# Altium project CCD_CAM_BOARD.PrjPcb (part 3 of 4)
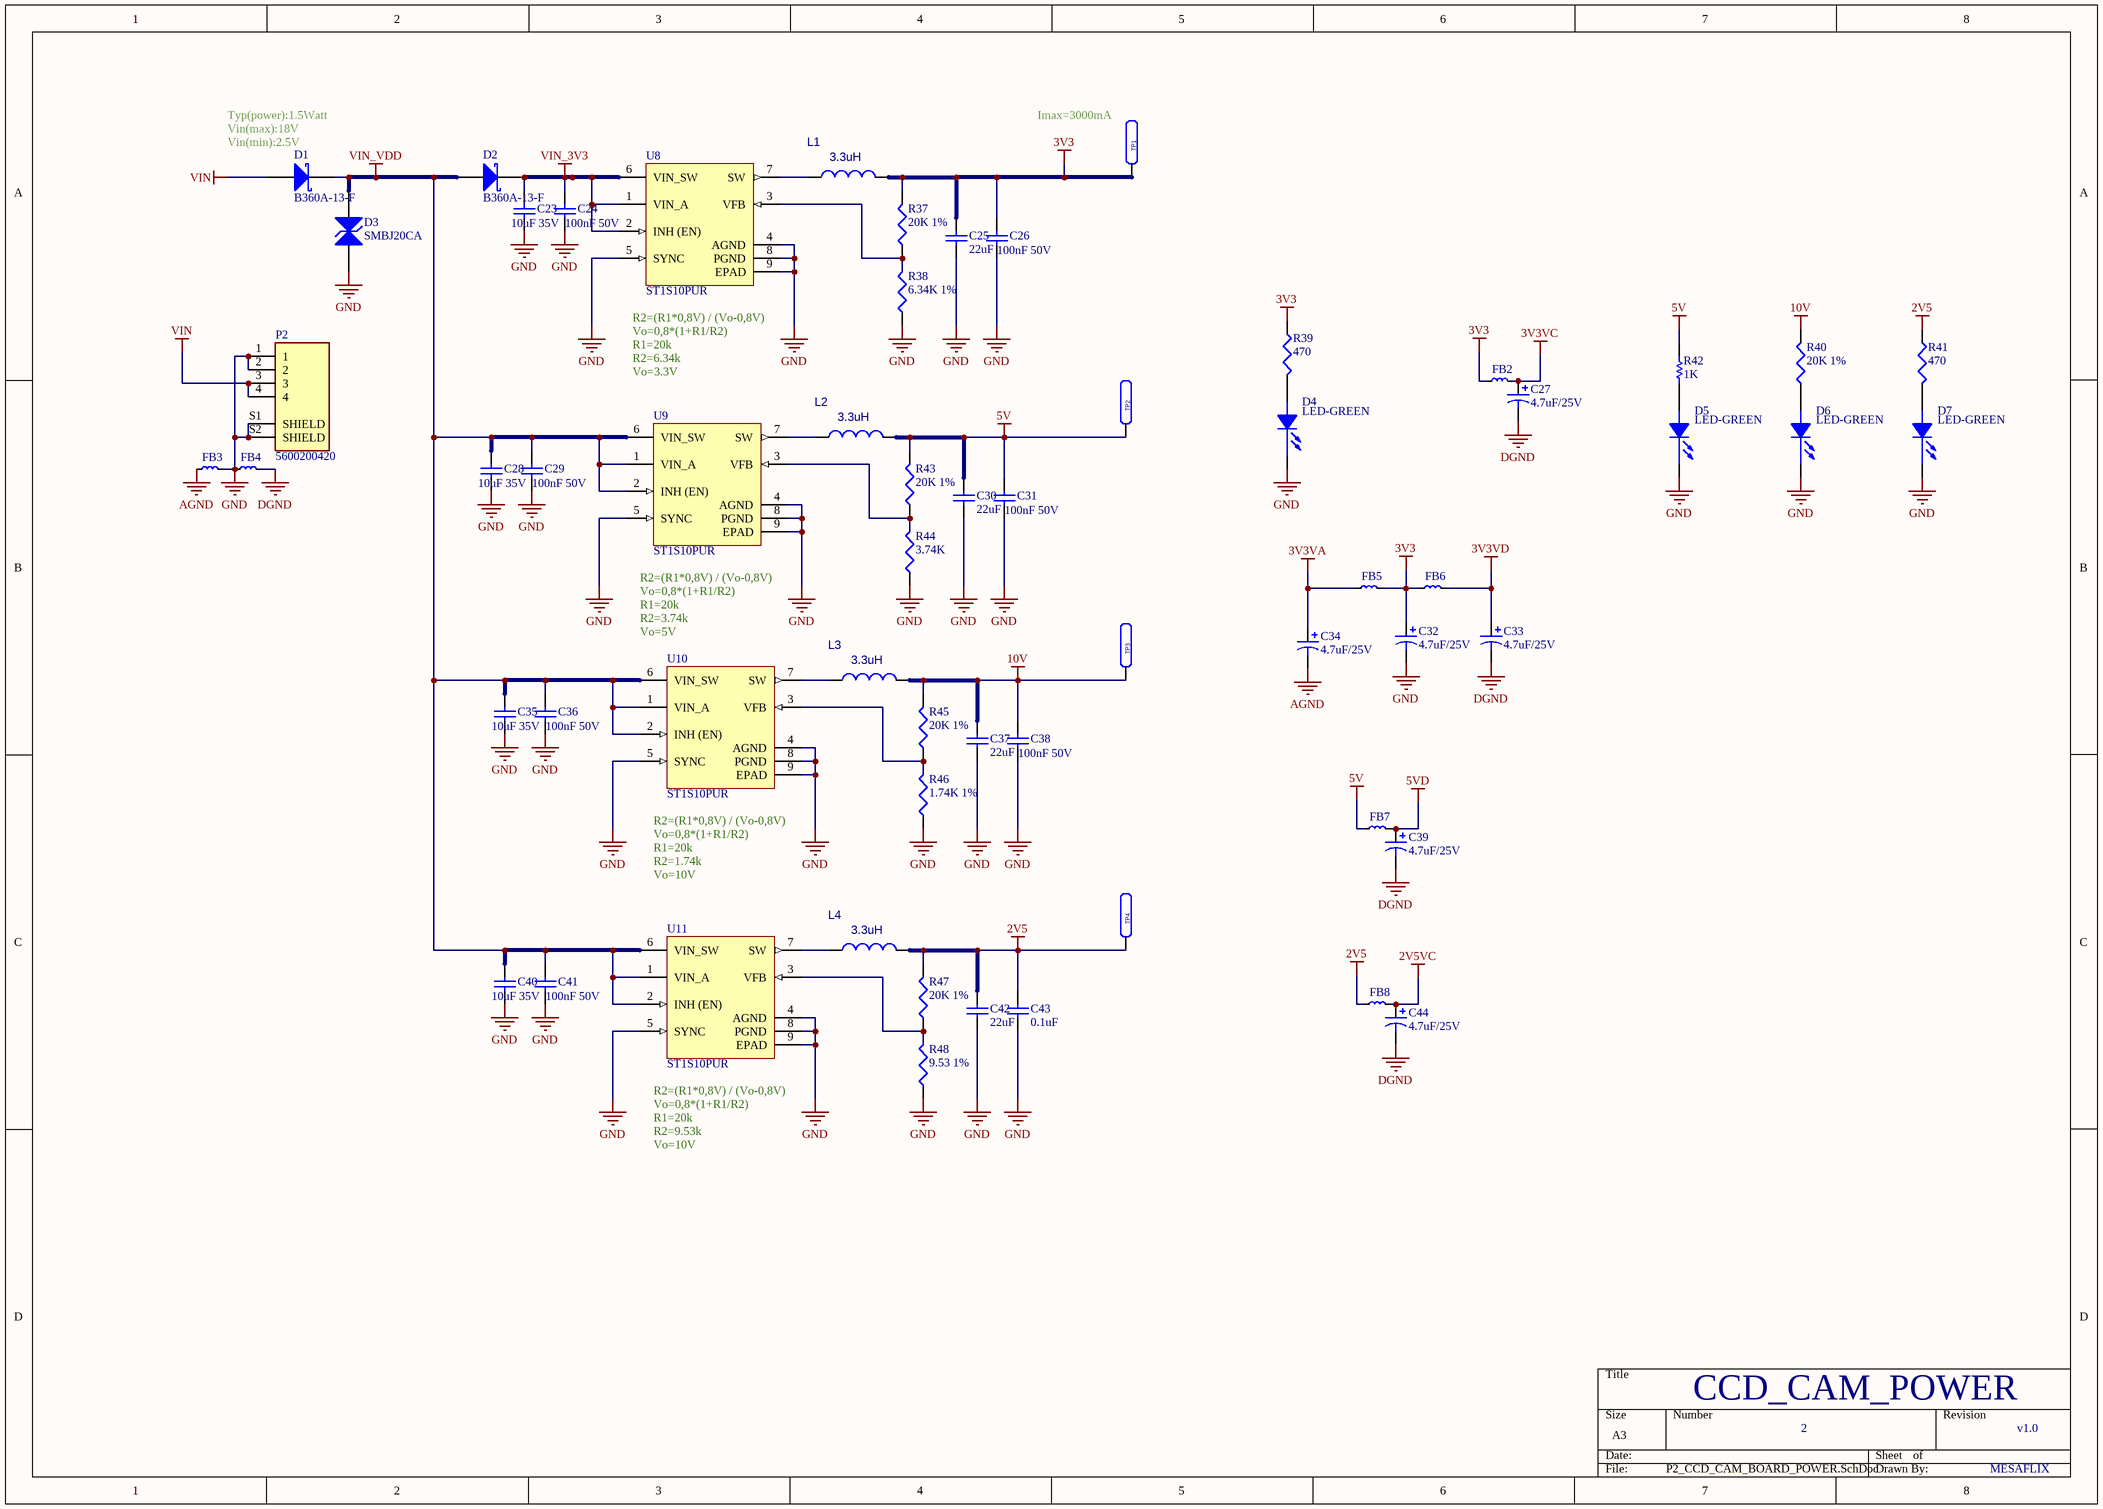
[diagram p8: P2_CCD_CAM_BOARD_POWER.SchDoc]

## Sheet P2_CCD_CAM_BOARD_POWER.SchDoc (continued)

### Library data of the parts (continued)
R46 = Res3: RES SMD 1.74K OHM 1% 1/16W 0402; MPN: RC0402FR-071K74L; ComponentLink1URL: https://datasheet.ciiva.com/11819/0900766b80c66297-11819477.pdf?src-supplier=RSComponents; ComponentLink1Description: https://datasheet.ciiva.com/11819/0900766b80c66297-11819477.pdf?src-supplier=RSComponents; ComponentLink2URL: https://datasheet.ciiva.com/12666/pyu-rc0402-51-rohs-l-6-r-12666741.pdf?src-supplier=Mouser; ComponentLink2Description: https://datasheet.ciiva.com/12666/pyu-rc0402-51-rohs-l-6-r-12666741.pdf?src-supplier=Mouser; ComponentLink3URL: https://datasheet.ciiva.com/17063/pyu-rc0402-51-rohs-l-6-r-17063193.pdf?src-supplier=Future+Electronics; ComponentLink3Description: https://datasheet.ciiva.com/17063/pyu-rc0402-51-rohs-l-6-r-17063193.pdf?src-supplier=Future+Electronics; ComponentLink4URL: https://datasheet.ciiva.com/22747/1018594-22747513.pdf?src-supplier=Element14; ComponentLink4Description: https://datasheet.ciiva.com/22747/1018594-22747513.pdf?src-supplier=Element14; ComponentLink5URL: https://datasheet.ciiva.com/7849/1018594-7849869.pdf?src-supplier=Element14; ComponentLink5Description: https://datasheet.ciiva.com/7849/1018594-7849869.pdf?src-supplier=Element14; ComponentLink6URL: https://datasheet.ciiva.com/7983/1018594-7983502.pdf?src-supplier=Element14; ComponentLink6Description: https://datasheet.ciiva.com/7983/1018594-7983502.pdf?src-supplier=Element14; ComponentLink7URL: https://datasheet.ciiva.com/7849/1018594-7849871.pdf?src-supplier=Element14; ComponentLink7Description: https://datasheet.ciiva.com/7849/1018594-7849871.pdf?src-supplier=Element14; ComponentLink8URL: https://datasheet.ciiva.com/2553/pyu-r-int-thick-7-2553200.pdf?src-supplier=Digi-Key; ComponentLink8Description: https://datasheet.ciiva.com/2553/pyu-r-int-thick-7-2553200.pdf?src-supplier=Digi-Key; ComponentLink9URL: https://datasheet.ciiva.com/7983/1018594-7983501.pdf?src-supplier=Element14; ComponentLink9Description: https://datasheet.ciiva.com/7983/1018594-7983501.pdf?src-supplier=Element14; ComponentLink10URL: https://datasheet.ciiva.com/2553/pyu-r-int-thick-7-2553201.pdf?src-supplier=Digi-Key; ComponentLink10Description: https://datasheet.ciiva.com/2553/pyu-r-int-thick-7-2553201.pdf?src-supplier=Digi-Key; ComponentLink11URL: https://datasheet.ciiva.com/2553/pyu-r-int-thick-7-2553202.pdf?src-supplier=Digi-Key; ComponentLink11Description: https://datasheet.ciiva.com/2553/pyu-r-int-thick-7-2553202.pdf?src-supplier=Digi-Key; ComponentLink12URL: https://datasheet.ciiva.com/15189/getdatasheetpartid-251817-15189388.pdf?src-supplier=Verical; ComponentLink12Description: https://datasheet.ciiva.com/15189/getdatasheetpartid-251817-15189388.pdf?src-supplier=Verical; ComponentLink13URL: https://datasheet.ciiva.com/11808/0900766b80c66297-11808454.pdf?src-supplier=RSComponents; ComponentLink13Description: https://datasheet.ciiva.com/11808/0900766b80c66297-11808454.pdf?src-supplier=RSComponents; ComponentLink14URL: https://datasheet.ciiva.com/2453/pyu-r-int-thick-7-2453494.pdf?src-supplier=Digi-Key; ComponentLink14Description: https://datasheet.ciiva.com/2453/pyu-r-int-thick-7-2453494.pdf?src-supplier=Digi-Key; ComponentLink15URL: https://datasheet.ciiva.com/2453/pyu-r-int-thick-7-2453495.pdf?src-supplier=Digi-Key; ComponentLink15Description: https://datasheet.ciiva.com/2453/pyu-r-int-thick-7-2453495.pdf?src-supplier=Digi-Key; ComponentLink16URL: https://datasheet.ciiva.com/7983/1018594-7983511.pdf?src-supplier=Element14; ComponentLink16Description: https://datasheet.ciiva.com/7983/1018594-7983511.pdf?src-supplier=Element14; ComponentLink17URL: https://datasheet.ciiva.com/12558/pyu-rc0402-51-rohs-l-6-r-8721-12558796.pdf?src-supplier=Mouser; ComponentLink17Description: https://datasheet.ciiva.com/12558/pyu-rc0402-51-rohs-l-6-r-8721-12558796.pdf?src-supplier=Mouser; ComponentLink18URL: https://datasheet.ciiva.com/2453/pyu-r-int-thick-7-2453493.pdf?src-supplier=Digi-Key; ComponentLink18Description: https://datasheet.ciiva.com/2453/pyu-r-int-thick-7-2453493.pdf?src-supplier=Digi-Key; ComponentLink19URL: https://datasheet.ciiva.com/46394/1018594-46394974.pdf?src-supplier=Element14; ComponentLink19Description: https://datasheet.ciiva.com/46394/1018594-46394974.pdf?src-supplier=Element14; ComponentLink20URL: https://datasheet.ciiva.com/15189/getdatasheetpartid-323692-15189807.pdf?src-supplier=Verical; ComponentLink20Description: https://datasheet.ciiva.com/15189/getdatasheetpartid-323692-15189807.pdf?src-supplier=Verical; ComponentLink21URL: https://datasheet.ciiva.com/2519/pyu-r-int-thick-7-2519204.pdf?src-supplier=Digi-Key; ComponentLink21Description: https://datasheet.ciiva.com/2519/pyu-r-int-thick-7-2519204.pdf?src-supplier=Digi-Key; ComponentLink22URL: https://datasheet.ciiva.com/2519/pyu-r-int-thick-7-2519205.pdf?src-supplier=Digi-Key; ComponentLink22Description: https://datasheet.ciiva.com/2519/pyu-r-int-thick-7-2519205.pdf?src-supplier=Digi-Key; ComponentLink23URL: https://datasheet.ciiva.com/2519/pyu-r-int-thick-7-2519206.pdf?src-supplier=Digi-Key; ComponentLink23Description: https://datasheet.ciiva.com/2519/pyu-r-int-thick-7-2519206.pdf?src-supplier=Digi-Key; ComponentLink24URL: https://datasheet.ciiva.com/5556/rk73h-5556598.pdf?src-supplier=Mouser; ComponentLink24Description: https://datasheet.ciiva.com/5556/rk73h-5556598.pdf?src-supplier=Mouser; ComponentLink25URL: https://datasheet.ciiva.com/16868/pyu-rc0402-51-rohs-l-6-16868119.pdf?src-supplier=Avnet+Europe; ComponentLink25Description: https://datasheet.ciiva.com/16868/pyu-rc0402-51-rohs-l-6-16868119.pdf?src-supplier=Avnet+Europe; ComponentLink26URL: https://datasheet.ciiva.com/8892/pyu-rc0402-51-rohs-l-6-8892634.pdf?src-supplier=Avnet; ComponentLink26Description: https://datasheet.ciiva.com/8892/pyu-rc0402-51-rohs-l-6-8892634.pdf?src-supplier=Avnet; ComponentLink27URL: https://datasheet.ciiva.com/28409/pyu-rc0402-51-rohs-l-6-28409292.pdf?src-supplier=Avnet+Europe; ComponentLink27Description: https://datasheet.ciiva.com/28409/pyu-rc0402-51-rohs-l-6-28409292.pdf?src-supplier=Avnet+Europe; ComponentLink28URL: https://datasheet.ciiva.com/2453/pyu-r-int-thick-7-2453629.pdf?src-supplier=Digi-Key; ComponentLink28Description: https://datasheet.ciiva.com/2453/pyu-r-int-thick-7-2453629.pdf?src-supplier=Digi-Key; ComponentLink29URL: https://datasheet.ciiva.com/2453/pyu-r-int-thick-7-2453630.pdf?src-supplier=Digi-Key; ComponentLink29Description: https://datasheet.ciiva.com/2453/pyu-r-int-thick-7-2453630.pdf?src-supplier=Digi-Key
R48 = Res3: RES SMD 5.53K OHM 1% 1/16W 0402; MPN: RC0603FR-079K53L; ComponentLink1URL: https://datasheet.ciiva.com/11819/0900766b80c66297-11819477.pdf?src-supplier=RSComponents; ComponentLink1Description: https://datasheet.ciiva.com/11819/0900766b80c66297-11819477.pdf?src-supplier=RSComponents; ComponentLink2URL: https://datasheet.ciiva.com/12666/pyu-rc0402-51-rohs-l-6-r-12666741.pdf?src-supplier=Mouser; ComponentLink2Description: https://datasheet.ciiva.com/12666/pyu-rc0402-51-rohs-l-6-r-12666741.pdf?src-supplier=Mouser; ComponentLink3URL: https://datasheet.ciiva.com/17063/pyu-rc0402-51-rohs-l-6-r-17063193.pdf?src-supplier=Future+Electronics; ComponentLink3Description: https://datasheet.ciiva.com/17063/pyu-rc0402-51-rohs-l-6-r-17063193.pdf?src-supplier=Future+Electronics; ComponentLink4URL: https://datasheet.ciiva.com/22747/1018594-22747513.pdf?src-supplier=Element14; ComponentLink4Description: https://datasheet.ciiva.com/22747/1018594-22747513.pdf?src-supplier=Element14; ComponentLink5URL: https://datasheet.ciiva.com/7849/1018594-7849869.pdf?src-supplier=Element14; ComponentLink5Description: https://datasheet.ciiva.com/7849/1018594-7849869.pdf?src-supplier=Element14; ComponentLink6URL: https://datasheet.ciiva.com/7983/1018594-7983502.pdf?src-supplier=Element14; ComponentLink6Description: https://datasheet.ciiva.com/7983/1018594-7983502.pdf?src-supplier=Element14; ComponentLink7URL: https://datasheet.ciiva.com/7849/1018594-7849871.pdf?src-supplier=Element14; ComponentLink7Description: https://datasheet.ciiva.com/7849/1018594-7849871.pdf?src-supplier=Element14; ComponentLink8URL: https://datasheet.ciiva.com/2553/pyu-r-int-thick-7-2553200.pdf?src-supplier=Digi-Key; ComponentLink8Description: https://datasheet.ciiva.com/2553/pyu-r-int-thick-7-2553200.pdf?src-supplier=Digi-Key; ComponentLink9URL: https://datasheet.ciiva.com/7983/1018594-7983501.pdf?src-supplier=Element14; ComponentLink9Description: https://datasheet.ciiva.com/7983/1018594-7983501.pdf?src-supplier=Element14; ComponentLink10URL: https://datasheet.ciiva.com/2553/pyu-r-int-thick-7-2553201.pdf?src-supplier=Digi-Key; ComponentLink10Description: https://datasheet.ciiva.com/2553/pyu-r-int-thick-7-2553201.pdf?src-supplier=Digi-Key; ComponentLink11URL: https://datasheet.ciiva.com/2553/pyu-r-int-thick-7-2553202.pdf?src-supplier=Digi-Key; ComponentLink11Description: https://datasheet.ciiva.com/2553/pyu-r-int-thick-7-2553202.pdf?src-supplier=Digi-Key; ComponentLink12URL: https://datasheet.ciiva.com/15189/getdatasheetpartid-251817-15189388.pdf?src-supplier=Verical; ComponentLink12Description: https://datasheet.ciiva.com/15189/getdatasheetpartid-251817-15189388.pdf?src-supplier=Verical; ComponentLink13URL: https://datasheet.ciiva.com/11808/0900766b80c66297-11808454.pdf?src-supplier=RSComponents; ComponentLink13Description: https://datasheet.ciiva.com/11808/0900766b80c66297-11808454.pdf?src-supplier=RSComponents; ComponentLink14URL: https://datasheet.ciiva.com/2453/pyu-r-int-thick-7-2453494.pdf?src-supplier=Digi-Key; ComponentLink14Description: https://datasheet.ciiva.com/2453/pyu-r-int-thick-7-2453494.pdf?src-supplier=Digi-Key; ComponentLink15URL: https://datasheet.ciiva.com/2453/pyu-r-int-thick-7-2453495.pdf?src-supplier=Digi-Key; ComponentLink15Description: https://datasheet.ciiva.com/2453/pyu-r-int-thick-7-2453495.pdf?src-supplier=Digi-Key; ComponentLink16URL: https://datasheet.ciiva.com/7983/1018594-7983511.pdf?src-supplier=Element14; ComponentLink16Description: https://datasheet.ciiva.com/7983/1018594-7983511.pdf?src-supplier=Element14; ComponentLink17URL: https://datasheet.ciiva.com/12558/pyu-rc0402-51-rohs-l-6-r-8721-12558796.pdf?src-supplier=Mouser; ComponentLink17Description: https://datasheet.ciiva.com/12558/pyu-rc0402-51-rohs-l-6-r-8721-12558796.pdf?src-supplier=Mouser; ComponentLink18URL: https://datasheet.ciiva.com/2453/pyu-r-int-thick-7-2453493.pdf?src-supplier=Digi-Key; ComponentLink18Description: https://datasheet.ciiva.com/2453/pyu-r-int-thick-7-2453493.pdf?src-supplier=Digi-Key; ComponentLink19URL: https://datasheet.ciiva.com/46394/1018594-46394974.pdf?src-supplier=Element14; ComponentLink19Description: https://datasheet.ciiva.com/46394/1018594-46394974.pdf?src-supplier=Element14; ComponentLink20URL: https://datasheet.ciiva.com/15189/getdatasheetpartid-323692-15189807.pdf?src-supplier=Verical; ComponentLink20Description: https://datasheet.ciiva.com/15189/getdatasheetpartid-323692-15189807.pdf?src-supplier=Verical; ComponentLink21URL: https://datasheet.ciiva.com/2519/pyu-r-int-thick-7-2519204.pdf?src-supplier=Digi-Key; ComponentLink21Description: https://datasheet.ciiva.com/2519/pyu-r-int-thick-7-2519204.pdf?src-supplier=Digi-Key; ComponentLink22URL: https://datasheet.ciiva.com/2519/pyu-r-int-thick-7-2519205.pdf?src-supplier=Digi-Key; ComponentLink22Description: https://datasheet.ciiva.com/2519/pyu-r-int-thick-7-2519205.pdf?src-supplier=Digi-Key; ComponentLink23URL: https://datasheet.ciiva.com/2519/pyu-r-int-thick-7-2519206.pdf?src-supplier=Digi-Key; ComponentLink23Description: https://datasheet.ciiva.com/2519/pyu-r-int-thick-7-2519206.pdf?src-supplier=Digi-Key; ComponentLink24URL: https://datasheet.ciiva.com/5556/rk73h-5556598.pdf?src-supplier=Mouser; ComponentLink24Description: https://datasheet.ciiva.com/5556/rk73h-5556598.pdf?src-supplier=Mouser; ComponentLink25URL: https://datasheet.ciiva.com/16868/pyu-rc0402-51-rohs-l-6-16868119.pdf?src-supplier=Avnet+Europe; ComponentLink25Description: https://datasheet.ciiva.com/16868/pyu-rc0402-51-rohs-l-6-16868119.pdf?src-supplier=Avnet+Europe; ComponentLink26URL: https://datasheet.ciiva.com/8892/pyu-rc0402-51-rohs-l-6-8892634.pdf?src-supplier=Avnet; ComponentLink26Description: https://datasheet.ciiva.com/8892/pyu-rc0402-51-rohs-l-6-8892634.pdf?src-supplier=Avnet; ComponentLink27URL: https://datasheet.ciiva.com/28409/pyu-rc0402-51-rohs-l-6-28409292.pdf?src-supplier=Avnet+Europe; ComponentLink27Description: https://datasheet.ciiva.com/28409/pyu-rc0402-51-rohs-l-6-28409292.pdf?src-supplier=Avnet+Europe; ComponentLink28URL: https://datasheet.ciiva.com/2453/pyu-r-int-thick-7-2453629.pdf?src-supplier=Digi-Key; ComponentLink28Description: https://datasheet.ciiva.com/2453/pyu-r-int-thick-7-2453629.pdf?src-supplier=Digi-Key; ComponentLink29URL: https://datasheet.ciiva.com/2453/pyu-r-int-thick-7-2453630.pdf?src-supplier=Digi-Key; ComponentLink29Description: https://datasheet.ciiva.com/2453/pyu-r-int-thick-7-2453630.pdf?src-supplier=Digi-Key
TP1-TP4 = LABTESTPOINT: OriginalSymbolOrigin: (0,50); PATH: I62; PACK_TYPE: PIN; SEC: 1; XY: (-650,5200); VER: 3; ROT: 0; LOCATION: TP501; DRAWING: @P3326_A01_LIB.P3326_A01(SCH_1):PAGE3; DEVICE_TYPENAME: LABTESTPOINT_PIN-LABTESTPOINT; CDS_LIB: electro_mechanic; SKU: COMMON; PHYS_PAGE: 3; CHIPS_PART_NAME: LABTESTPOINT; CDS_SEC: 1; CDS_PHYS_PART_NAME: LABTESTPOINT_PIN-LABTESTPOINT; CDS_PART_NAME: LABTESTPOINT_PIN-LABTESTPOINT; CDS_LOCATION: TP501
U8-U11 = CMP-0240-00156-1: Monolithic synchronous step-down regulator, 8-Pin DFN, Tape and Reel; Manufacturer: STMicroelectronics; Output Current: 3A; Switching Frequency: 1.2MHz; Operating Supply Voltage: 18V; Number of Outputs: 1; Output Voltage: 15.3V; Min Input Voltage: 2.5V; Efficiency: 90%; Quiescent Current: 2.5mA; Output Type: Adjustable; Synchronous Rectifier: Yes; Min Output Voltage: 800mV; ComponentLink1URL: http://www.st.com; ComponentLink2Description: Datasheet; ComponentLink1Description: Manufacturer URL; ComponentLink2URL: http://www.st.com/internet/com/TECHNICAL_RESOURCES/TECHNICAL_LITERATURE/DATASHEET/CD00169322.pdf; Supplier 1: Digi-Key; Supplier Part Number 1: 497-6313-1-ND; Manufacturer Part Number: ST1S10PUR; RoHS: Yes; Category: Voltage Regulators - Switching; Stock 1: 402; Pricing 1: 1=1,73000, 10=1,55600, 25=1,46760, 100=1,17400, 250=1,02724, 500=0,99790, 1000=0,79245 (USD); Mount: Surface Mount; Case/Package: DFN; Number of Pins: 8; Weight: 0.001319oz; Min Operating Temperature: -25°C; Max Operating Temperature: 125°C; Package Quantity: 4500; Packaging: Tape and Reel; Max Input Voltage: 18V; Max Duty Cycle: 90%; Max Output Current: 3A; Max Output Voltage: 15.3V; Length: 4mm; Height: 0.9mm; Width: 4mm; Radiation Hardening: No; Lead Free: Lead Free; REACH SVHC: No SVHC; ComponentLink3URL: https://datasheet.ciiva.com/15113/getdatasheetpartid-188392-15113798.pdf?src-supplier=Verical; ComponentLink3Description: https://datasheet.ciiva.com/15113/getdatasheetpartid-188392-15113798.pdf?src-supplier=Verical; ComponentLink4URL: https://datasheet.ciiva.com/26902/st1s10pur-26902772.pdf?src-supplier=IIIC; ComponentLink4Description: https://datasheet.ciiva.com/26902/st1s10pur-26902772.pdf?src-supplier=IIIC; ComponentLink5URL: https://datasheet.ciiva.com/2025/cd00169322-2025410.pdf?src-supplier=Digi-Key; ComponentLink5Description: https://datasheet.ciiva.com/2025/cd00169322-2025410.pdf?src-supplier=Digi-Key; ComponentLink6URL: https://datasheet.ciiva.com/2025/cd00169322-2025408.pdf?src-supplier=Digi-Key; ComponentLink6Description: https://datasheet.ciiva.com/2025/cd00169322-2025408.pdf?src-supplier=Digi-Key; ComponentLink7URL: https://datasheet.ciiva.com/2025/cd00169322-2025409.pdf?src-supplier=Digi-Key; ComponentLink7Description: https://datasheet.ciiva.com/2025/cd00169322-2025409.pdf?src-supplier=Digi-Key; ComponentLink8URL: https://datasheet.ciiva.com/16205/cd00169322-16205241.pdf?src-supplier=Future+Electronics; ComponentLink8Description: https://datasheet.ciiva.com/16205/cd00169322-16205241.pdf?src-supplier=Future+Electronics; ComponentLink9URL: https://datasheet.ciiva.com/4905/cd00169322-4905020.pdf?src-supplier=Mouser; ComponentLink9Description: https://datasheet.ciiva.com/4905/cd00169322-4905020.pdf?src-supplier=Mouser; ComponentLink10URL: https://datasheet.ciiva.com/41457/001185576-da-01-en-ic-reg-buck-sync-a-st1s10pur-3adfn-8-stm-41457644.pdf?src-supplier=Conrad; ComponentLink10Description: https://datasheet.ciiva.com/41457/001185576-da-01-en-ic-reg-buck-sync-a-st1s10pur-3adfn-8-stm-41457644.pdf?src-supplier=Conrad

## Sheet P4_CCD_CAM_BOARD_MCU.SchDoc
size A4
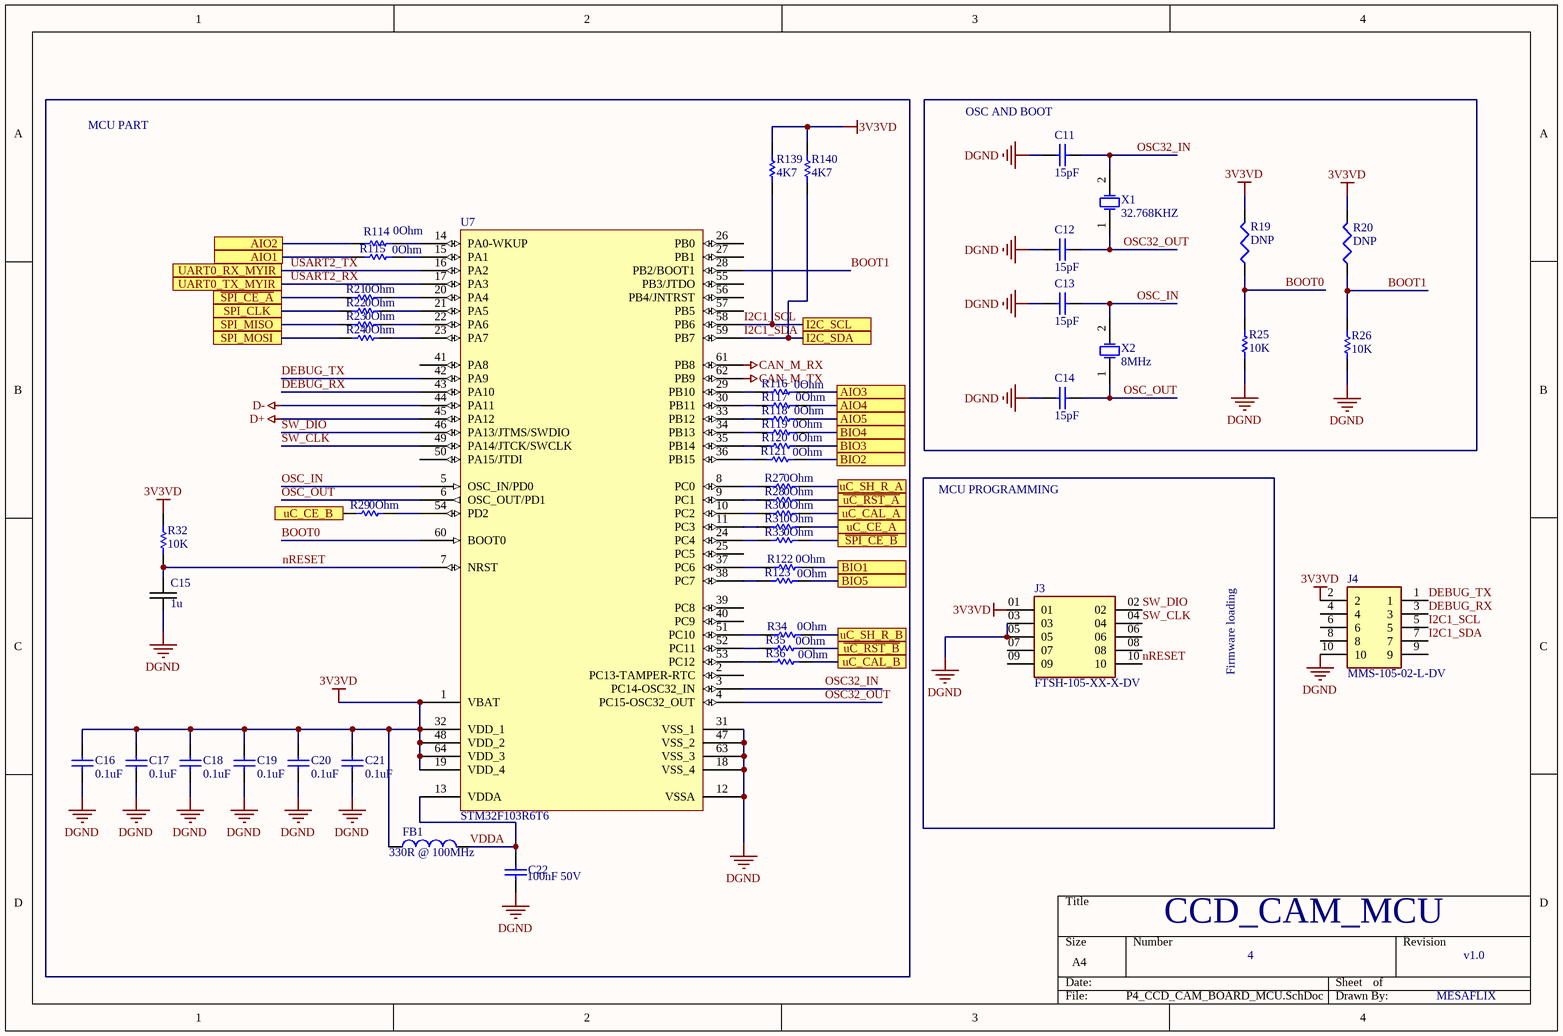
[diagram p2: P4_CCD_CAM_BOARD_MCU.SchDoc]

### Parts
C11  15pF  [CAP0603]
C12  15pF  [CAP0603]
C13  15pF  [CAP0603]
C14  15pF  [CAP0603]
C15  value 1u  [C0603]  (hidden comment: 1uF)
C16  0.1uF  [C 0402(1005)x0.5]
C17  0.1uF  [C 0402(1005)x0.5]
C18  0.1uF  [C 0402(1005)x0.5]
C19  0.1uF  [C 0402(1005)x0.5]
C20  0.1uF  [C 0402(1005)x0.5]
C21  0.1uF  [C 0402(1005)x0.5]
C22  100nF 50V  [CAP0603]
FB1  330R @ 100MHz  [FB0603]
J3  FTSH-105-XX-X-DV  [SAMTEC_FTSH-105-XX-X-DV]
J4  MMS-105-02-L-DV  [SAMTEC_MMS-105-02-L-DV]
R19  Assembly: DNP  [RES0603]  (hidden comment: 10k)
R20  Assembly: DNP  [RES0603]  (hidden comment: 10k)
R21  value 0Ohm  [R 0402(1005)]  (hidden comment: RES_DNP_0603)
R22  value 0Ohm  [R 0402(1005)]  (hidden comment: RES_DNP_0603)
R23  value 0Ohm  [R 0402(1005)]  (hidden comment: RES_DNP_0603)
R24  value 0Ohm  [R 0402(1005)]  (hidden comment: RES_DNP_0603)
R25  value 10K  [RES0603]  (hidden comment: RES_10K_0603)
R26  value 10K  [RES0603]  (hidden comment: RES_10K_0603)
R27  value 0Ohm  [R 0402(1005)]  (hidden comment: RES_DNP_0603)
R28  value 0Ohm  [R 0402(1005)]  (hidden comment: RES_DNP_0603)
R29  value 0Ohm  [R 0402(1005)]  (hidden comment: RES_DNP_0603)
R30  value 0Ohm  [R 0402(1005)]  (hidden comment: RES_DNP_0603)
R31  value 0Ohm  [R 0402(1005)]  (hidden comment: RES_DNP_0603)
R32  value 10K  [RES0603]  (hidden comment: RES_10K_0603)
R33  value 0Ohm  [R 0402(1005)]  (hidden comment: RES_DNP_0603)
R34  value 0Ohm  [R 0402(1005)]  (hidden comment: RES_DNP_0603)
R35  value 0Ohm  [R 0402(1005)]  (hidden comment: RES_DNP_0603)
R36  value 0Ohm  [R 0402(1005)]  (hidden comment: RES_DNP_0603)
R114  value 0Ohm  [R 0402(1005)]  (hidden comment: RES_DNP_0603)
R115  value 0Ohm  [R 0402(1005)]  (hidden comment: RES_DNP_0603)
R116  value 0Ohm  [R 0402(1005)]  (hidden comment: RES_DNP_0603)
R117  value 0Ohm  [R 0402(1005)]  (hidden comment: RES_DNP_0603)
R118  value 0Ohm  [R 0402(1005)]  (hidden comment: RES_DNP_0603)
R119  value 0Ohm  [R 0402(1005)]  (hidden comment: RES_DNP_0603)
R120  value 0Ohm  [R 0402(1005)]  (hidden comment: RES_DNP_0603)
R121  value 0Ohm  [R 0402(1005)]  (hidden comment: RES_DNP_0603)
R122  value 0Ohm  [R 0402(1005)]  (hidden comment: RES_DNP_0603)
R123  value 0Ohm  [R 0402(1005)]  (hidden comment: RES_DNP_0603)
R139  value 4K7  [CAP_RES_1608_0603]  (hidden comment: RES_4K7_0603)
R140  value 4K7  [CAP_RES_1608_0603]  (hidden comment: RES_4K7_0603)
U7  STM32F103R6T6  [LQFP64_N]
X1  32.768KHZ  [CRY_ABS07]
X2  8MHz  [CRY_NX8045GB]

### Ports
AIO1, AIO2, AIO3, AIO4, AIO5, BIO1, BIO2, BIO3, BIO4, BIO5, I2C_SCL, I2C_SDA, SPI_CLK, SPI_MISO, SPI_MOSI, UART0_RX_MYIR, UART0_TX_MYIR, uC_CAL_A, uC_CAL_B, uC_CE_A, uC_CE_B, uC_SH_R_A, uC_SH_R_B, ~{SPI_CE_A}, ~{SPI_CE_B}, ~{uC_RST_A}, ~{uC_RST_B}

### Nets
3V3VD: C16.2 C17.2 C18.2 C19.2 C20.2 C21.2 FB1.1 J3.01 J4.2 R19.2 R20.2 R32.1 R139.1 R140.1 U7.1(VBAT) U7.19(VDD_4) U7.32(VDD_1) U7.48(VDD_2) U7.64(VDD_3)  [project net VDD_3V3]
CAN_M_RX: U7.61(PB8)  [project net CAN_MCU_N]
CAN_M_TX: U7.62(PB9)  [project net CAN_MCU_P]
D+: U7.45(PA12)  [project net USB_P]
D-: U7.44(PA11)  [project net USB_N]
DGND: C11.1 C12.1 C13.1 C14.1 C15.2 C16.1 C17.1 C18.1 C19.1 C20.1 C21.1 C22.1 J3.03 J3.05 J4.10 R25.2 R26.2 U7.12(VSSA) U7.18(VSS_4) U7.31(VSS_1) U7.47(VSS_2) U7.63(VSS_3)
BOOT0: R19.1 R25.1 U7.60(BOOT0)
BOOT1: R20.1 R26.1 U7.28(PB2/BOOT1)
DEBUG_RX: J4.3 U7.43(PA10)
DEBUG_TX: J4.1 U7.42(PA9)
I2C1_SCL: J4.5 R139.2 U7.58(PB6) ; port I2C_SCL
I2C1_SDA: J4.7 R140.2 U7.59(PB7) ; port I2C_SDA
nRESET: C15.1 J3.10 R32.2 U7.7(NRST)
OSC32_IN: C11.2 U7.3(PC14-OSC32_IN) X1.2(OSC2)
OSC32_OUT: C12.2 U7.4(PC15-OSC32_OUT) X1.1(OSC1)
OSC_IN: C13.2 U7.5(OSC_IN/PD0) X2.2(OSC2)
OSC_OUT: C14.2 U7.6(OSC_OUT/PD1) X2.1(OSC1)
SW_CLK: J3.04 U7.49(PA14/JTCK/SWCLK)
SW_DIO: J3.02 U7.46(PA13/JTMS/SWDIO)
USART2_RX: U7.17(PA3) ; port UART0_TX_MYIR
USART2_TX: U7.16(PA2) ; port UART0_RX_MYIR
VDDA: C22.2 FB1.2 U7.13(VDDA)
NetR21_1: R21.1 ; port ~{SPI_CE_A}
NetR21_2: R21.2 U7.20(PA4)
NetR22_1: R22.1 ; port SPI_CLK
NetR22_2: R22.2 U7.21(PA5)
NetR23_1: R23.1 ; port SPI_MISO
NetR23_2: R23.2 U7.22(PA6)
NetR24_1: R24.1 ; port SPI_MOSI
NetR24_2: R24.2 U7.23(PA7)
NetR27_1: R27.1 U7.8(PC0)
NetR27_2: R27.2 ; port uC_SH_R_A
NetR28_1: R28.1 U7.9(PC1)
NetR28_2: R28.2 ; port ~{uC_RST_A}
NetR29_1: R29.1 ; port uC_CE_B
NetR29_2: R29.2 U7.54(PD2)
NetR30_1: R30.1 U7.10(PC2)
NetR30_2: R30.2 ; port uC_CAL_A
NetR31_1: R31.1 U7.11(PC3)
NetR31_2: R31.2 ; port uC_CE_A
NetR33_1: R33.1 U7.24(PC4)
NetR33_2: R33.2 ; port ~{SPI_CE_B}
NetR34_1: R34.1 U7.51(PC10)
NetR34_2: R34.2 ; port uC_SH_R_B
NetR35_1: R35.1 U7.52(PC11)
NetR35_2: R35.2 ; port ~{uC_RST_B}
NetR36_1: R36.1 U7.53(PC12)
NetR36_2: R36.2 ; port uC_CAL_B
NetR104_2: R115.2 ; port AIO1
NetR105_2: R114.2 ; port AIO2
NetR106_1: R116.2 ; port AIO3
NetR107_2: R123.2 ; port BIO5
NetR108_1: R117.2 ; port AIO4
NetR109_2: R122.2 ; port BIO1
NetR110_1: R118.2 ; port AIO5
NetR111_2: R121.2 ; port BIO2
NetR112_2: R120.2 ; port BIO3
NetR113_2: R119.2 ; port BIO4
NetR114_1: R114.1 U7.14(PA0-WKUP)
NetR115_1: R115.1 U7.15(PA1)
NetR116_1: R116.1 U7.29(PB10)
NetR117_1: R117.1 U7.30(PB11)
NetR118_1: R118.1 U7.33(PB12)
NetR119_1: R119.1 U7.34(PB13)
NetR120_1: R120.1 U7.35(PB14)
NetR121_1: R121.1 U7.36(PB15)
NetR122_1: R122.1 U7.37(PC6)
NetR123_1: R123.1 U7.38(PC7)

Not connected (* = marked no-connect by the designer): J3 06 07 08 09; J4 4 6 8 9; U7 2(PC13-TAMPER-RTC) 25(PC5) 26(PB0) 27(PB1) 39(PC8) 40(PC9) 41(PA8) 50(PA15/JTDI) 55(PB3/JTDO) 56(PB4/JNTRST) 57(PB5)

### Notes on the sheet
- (near C11) OSC AND BOOT
- MCU PART
- MCU PROGRAMMING
- Firmware loading
- CCD_CAM_MCU
- 4
- v1.0
- MESAFLIX

### Library data of the parts
C11-C14 = CAP0603_15pF: CAP CER 15PF 50V C0G/NP0 0603; P/N: 06035A150JAT4A; Order Code: DIGI : 478-10677-1-ND; Value: 15pF 50V
C15 = 1: CAP CER 1UF 25V X7R 0603; Manufacturer Part Number: CL10B105KA8NNNC; ID: 1; Type: Ceramic Capacitor; Package: SMD0603; Digikey Part Number: 1276-1184-1-ND
C16-C21 = Cap: Capacitor; Manufacturer: Murata; Manufacturer Part Number: GRM155R71C104KA88D; Material: Ceramic; Capacitance: 100nF; Tolerance: 10%; Dielectric: X7R; Voltage Rating: 16V; Insulation Resistance: 10GR; Supplier 1: Digi-Key; Supplier Part Number 1: 490-3261-6-ND; Stock 1: 141162259; Pricing 1: 1 = 0,10000, 10 = 0,03300, 100 = 0,01470, 500 = 0,01046, 1000 = 0,00822, 2500 = 0,00748, 5000 = 0,00688 (USD); RoHS: Yes; Mount: Surface Mount; Case/Package: 0402; Number of Pins: 2; Case Code (Metric): 1005; Case Code (Imperial): 0402; Dielectric Material: Ceramic; Min Operating Temperature: -55°C; Max Operating Temperature: 125°C; Packaging: Tape and Reel; Voltage Rating (DC): 16V; Package Quantity: 1; Termination: SMD/SMT; Voltage: 16V; Length: 1mm; Height: 0.5mm; Width: 0.5mm; Thickness: 0.022inch; Depth: 0.5mm; Radiation Hardening: No; REACH SVHC: No SVHC; Lead Free: Lead Free; ComponentLink1URL: https://datasheet.ciiva.com/18102/getdatasheetpartid-85307-18102905.pdf?src-supplier=Verical; ComponentLink1Description: https://datasheet.ciiva.com/18102/getdatasheetpartid-85307-18102905.pdf?src-supplier=Verical; ComponentLink2URL: https://datasheet.ciiva.com/129/grm155r71c104ka88-01-129739.pdf?src-supplier=Digi-Key; ComponentLink2Description: https://datasheet.ciiva.com/129/grm155r71c104ka88-01-129739.pdf?src-supplier=Digi-Key; ComponentLink3URL: https://datasheet.ciiva.com/129/grm155r71c104ka88-01-129740.pdf?src-supplier=Digi-Key; ComponentLink3Description: https://datasheet.ciiva.com/129/grm155r71c104ka88-01-129740.pdf?src-supplier=Digi-Key; ComponentLink4URL: https://datasheet.ciiva.com/29199/454098-da-01-en-vs-kondensator-0402-29199799.pdf?src-supplier=Conrad; ComponentLink4Description: https://datasheet.ciiva.com/29199/454098-da-01-en-vs-kondensator-0402-29199799.pdf?src-supplier=Conrad; ComponentLink5URL: https://datasheet.ciiva.com/28534/4360-28534133.pdf?src-supplier=Element14; ComponentLink5Description: https://datasheet.ciiva.com/28534/4360-28534133.pdf?src-supplier=Element14; ComponentLink6URL: https://datasheet.ciiva.com/14103/grmseries-highdielectrictype-eng-14103750.pdf?src-supplier=Distrelec; ComponentLink6Description: https://datasheet.ciiva.com/14103/grmseries-highdielectrictype-eng-14103750.pdf?src-supplier=Distrelec; ComponentLink7URL: https://datasheet.ciiva.com/16199/product-16199000.pdf?src-supplier=Future+Electronics; ComponentLink7Description: https://datasheet.ciiva.com/16199/product-16199000.pdf?src-supplier=Future+Electronics; ComponentLink8URL: https://datasheet.ciiva.com/14116/grmseries-highdielectrictype-eng-14116878.pdf?src-supplier=Distrelec; ComponentLink8Description: https://datasheet.ciiva.com/14116/grmseries-highdielectrictype-eng-14116878.pdf?src-supplier=Distrelec; ComponentLink9URL: https://datasheet.ciiva.com/7937/4360-7937615.pdf?src-supplier=Element14; ComponentLink9Description: https://datasheet.ciiva.com/7937/4360-7937615.pdf?src-supplier=Element14; ComponentLink10URL: https://datasheet.ciiva.com/28534/4360-28534127.pdf?src-supplier=Element14; ComponentLink10Description: https://datasheet.ciiva.com/28534/4360-28534127.pdf?src-supplier=Element14
C22 = CAP0603_100nF: CAP CER 0.1UF 50V X7R 0603; P/N: C0603C104K5RACTU; Order Code: DIGI : 399-5089-1-ND; Value: 100nF 50V
FB1 = FB0603_330R@100MHz: FERRITE BEAD 330 OHM 0603 1LN; P/N: BLM18SG331TN1D; Order Code: DIGI : 490-3997-1-ND; Value: 330R @ 100MHz
J3 = FTSH-105-XX-X-DV: Connector Header Surface Mount 10 position 0.050 (1.27mm); MF: Samtec; MP: FTSH-105-01-L-DV; SnapEDA_Link: https://www.snapeda.com/parts/FTSH-105-01-L-DV/Samtec/view-part/4795786/?ref=snap; Purchase-URL: https://pricing.snapeda.com/search/part/FTSH-105-01-L-DV/?ref=eda; Check_prices: https://www.snapeda.com/parts/FTSH-105-01-L-DV/Samtec/view-part/4795786/?ref=eda; Value: *; Availability: Bad; Price: None; Package: None
J4 = MMS-105-02-L-DV: 10 Position Receptacle Connector Surface Mount; MF: Samtec; Price: None; Package: None; Toby_UK-Purchase-URL: https://snapeda.com/shop?store=Toby+UK&id=4795617; Availability: Bad; MP: MMS-105-02-L-DV; Value: *; SnapEDA_Link: https://www.snapeda.com/parts/MMS-105-02-L-DV/Samtec/view-part/4795617/?ref=snap
R19 R20 = RES0603_10k: RES SMD 10K OHM 5% 1/10W 0603; Order Code: DIGI : 311-10KGRCT-ND; P/N: RC0603JR-0710KL; Value: 10k
R21-R24 R27-R31 R33-R36 R114-R123 = RES_1K_0603: Manufacturer: Yageo; ManufacturerPartNumber: AC0603FR-070RL; DetailedDesctiprition: 0 Ohms Jumper 0.1W, 1/10W Chip Resistor 0603 (1608 Metric) Automotive AEC-Q200, Moisture Resistant Thick Film; DigikeyPartNumber: 311-0.0LDCT-ND
R25 R26 R32 = RES_1K_0603: Manufacturer: Yageo; ManufacturerPartNumber: AT0603FRE0710KL; DetailedDesctiprition: 10 kOhms ±1% 0.1W, 1/10W Chip Resistor 0603 (1608 Metric) Anti-Sulfur, Automotive AEC-Q200, Moisture Resistant Thin Film; DigikeyPartNumber: YAG2122CT-ND
R139 R140 = RES_1K_0603: Manufacturer: Yageo; ManufacturerPartNumber: AC0603JR-074K7L; DetailedDesctiprition: 4.7 kOhms ±1% 0.05W, 1/20W Chip Resistor 0603 (1608 Metric) Automotive AEC-Q200, Moisture Resistant Thick Film; DigikeyPartNumber: YAG3676CT-ND
U7 = STM32F103R6T6: STM32 ARM-based 32-bit MCU with 32 Kbytes Flash, 64-pin LQFP, Industrial Temperature; Published: 30-May-2008; DatasheetVersion: rev6, Mar-2008; PackageVersion: Mar-2008; PackageReference: LQFP64; Publisher: Altium Limited; PackageDescription: 64-Pin Low-Profile Quad Flat Pack, 10 x 10 mm Body, 0.5 mm Pitch (LQFP64); ComponentLink1Description: Manufacturer Link; ComponentLink1URL: www.st.com/stm32; ComponentLink2Description: Datasheet; ComponentLink2URL: http://www.st.com/stonline/products/literature/ds/13587.pdf
X1 = CRY_32.768KHZ: CRYSTAL 32.768KHZ 12.5PF SMD; P/N: CM7V-T1A-32.768KHZ-12.5PF-20PPM-TB-QA; Order Code: DIGI : 2195-CM7V-T1A-32.768KHZ-12.5PF-20PPM-TB-QACT-ND; Value: 32.768KHZ
X2 = CRY_NX8045GB-8.000M-STD-CSJ-1: CRYSTAL 8.0000MHZ 8PF SMD; Order Code: DIGI : 644-1206-1-ND; P/N: NX8045GB-8.000M-STD-CSJ-1; Value: 8MHz

## Sheet P8_CCD_CAM_BOARD_COMM.SchDoc
size A3
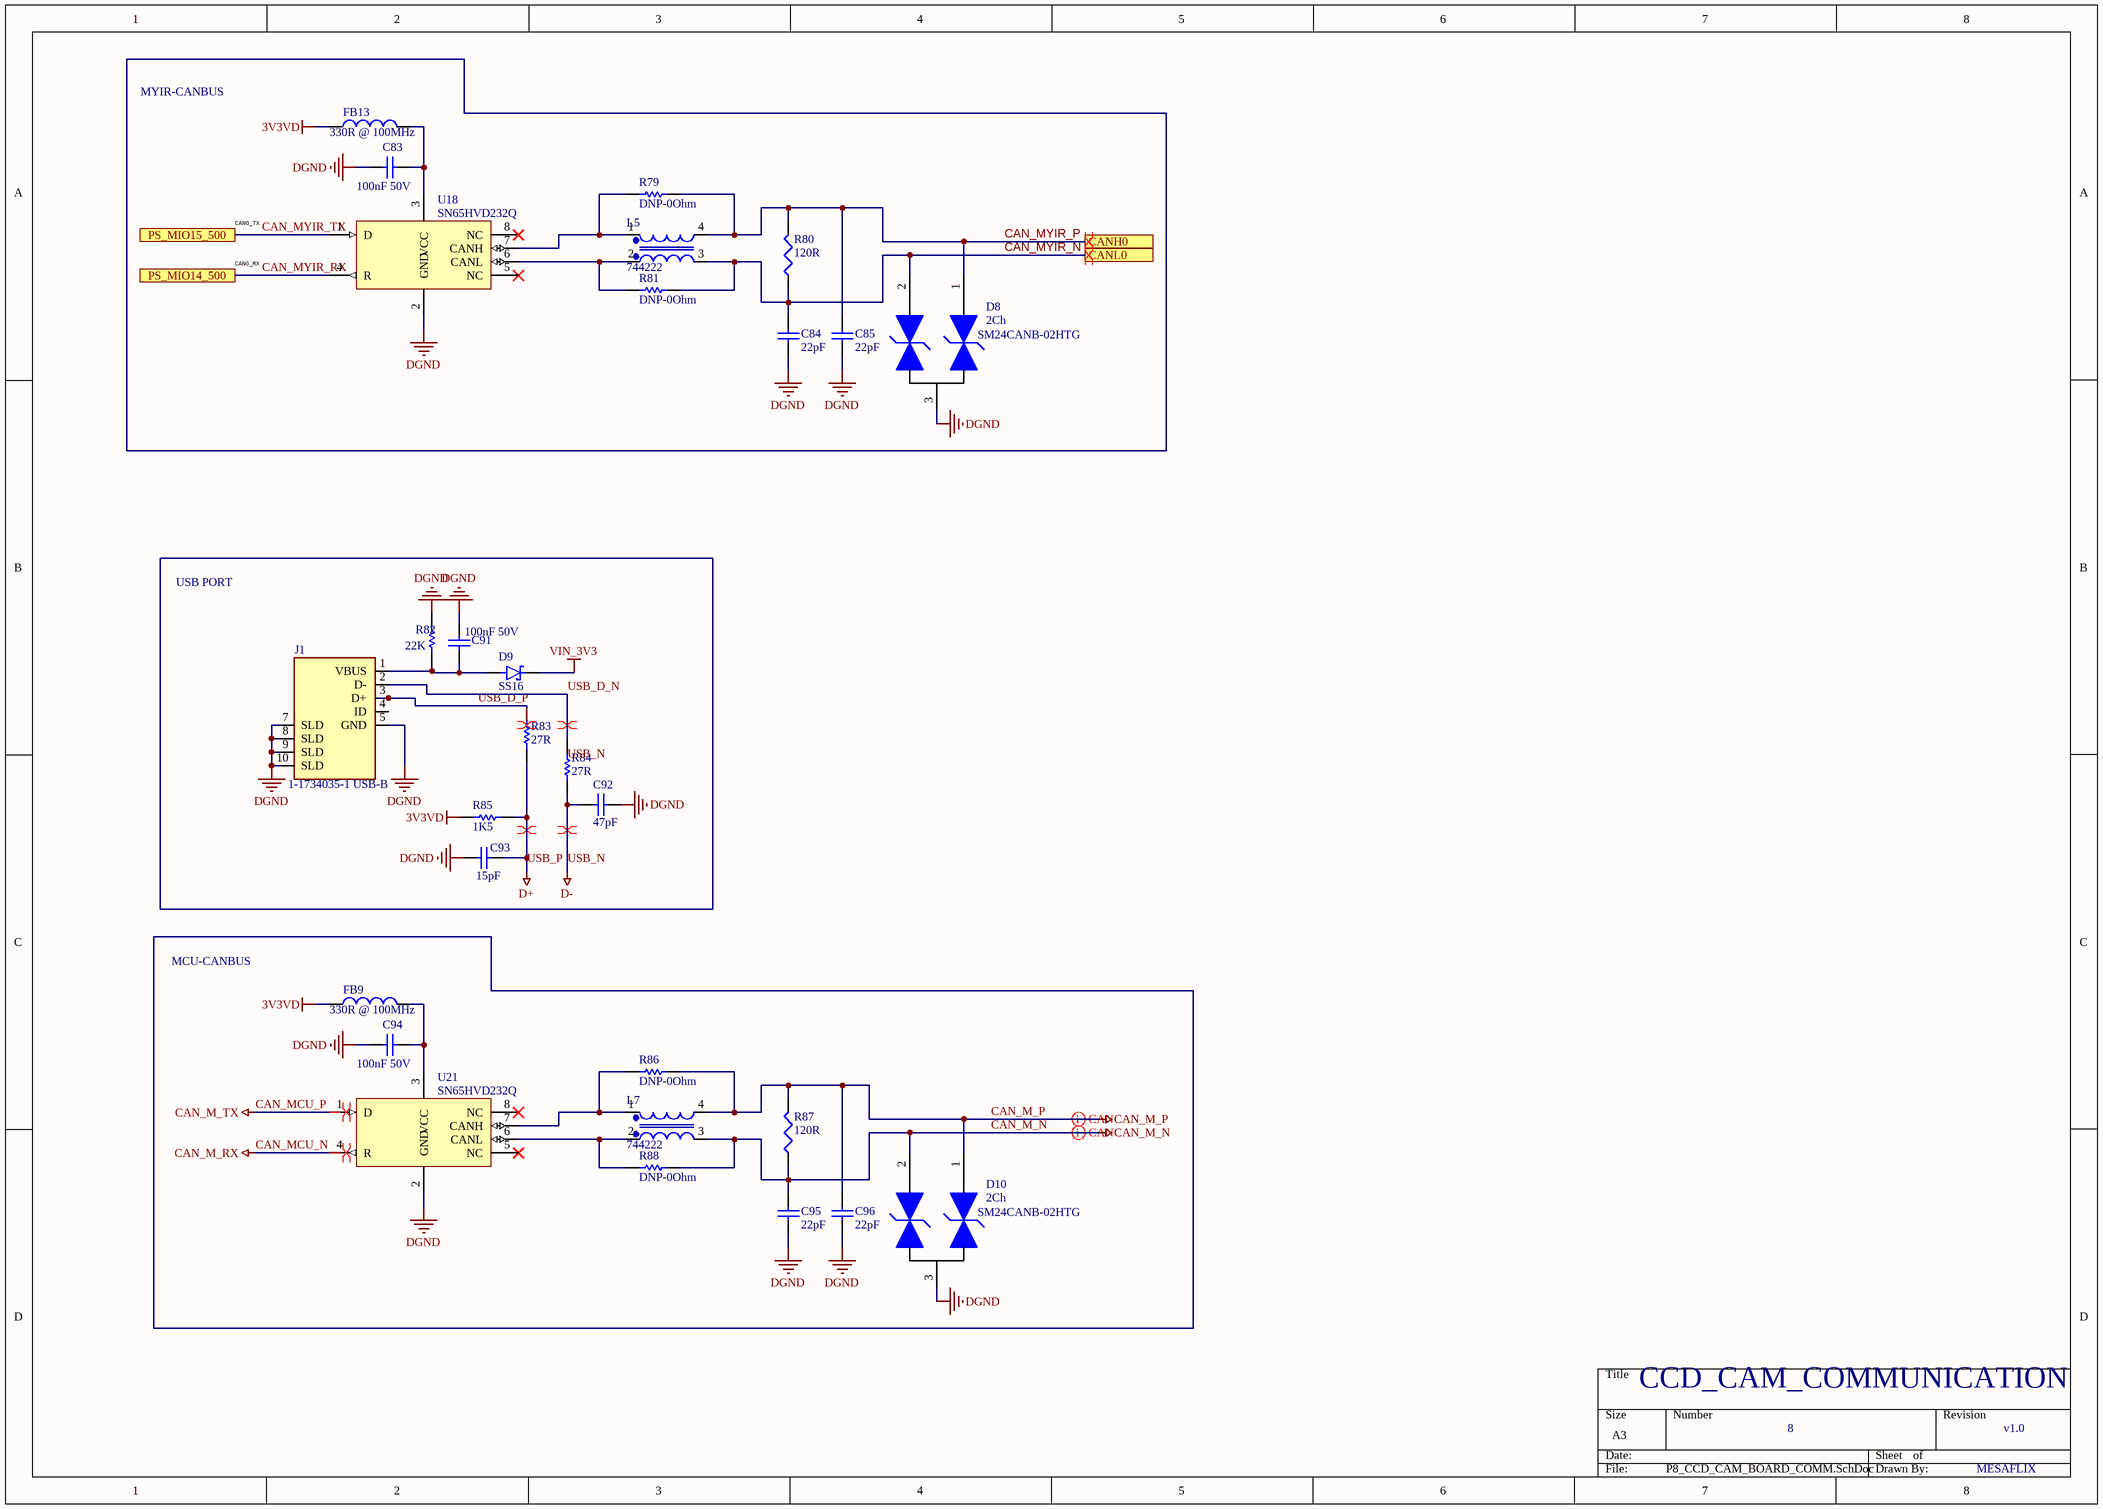
[diagram p3: P8_CCD_CAM_BOARD_COMM.SchDoc]

### Parts
C83  100nF 50V  [CAP0603]
C84  22pF  [CAP0603]
C85  22pF  [CAP0603]
C91  100nF 50V  [CAP0603]
C92  47pF  [CAP0603]
C93  15pF  [CAP0603]
C94  100nF 50V  [CAP0603]
C95  22pF  [CAP0603]
C96  22pF  [CAP0603]
D8  2Ch  P/N: SM24CANB-02HTG  [SOT23_3-DIODE]
D9  SS16  [DIOM5227X250N]
D10  2Ch  P/N: SM24CANB-02HTG  [SOT23_3-DIODE]
FB9  330R @ 100MHz  [FB0603]
FB13  330R @ 100MHz  [FB0603]
J1  1-1734035-1 USB-B  [TE_1-1734035-1-3D]
L5  744222  [IND_744222_3D]  (value not drawn)
L7  744222  [IND_744222_3D]  (value not drawn)
R79  value DNP-0Ohm  [RES0603]  (hidden comment: RES_DNP_0603)
R80  120R  [RES0603]
R81  value DNP-0Ohm  [RES0603]  (hidden comment: RES_DNP_0603)
R82  value 22K  [RES0603]  (hidden comment: RES_22K_0603)
R83  value 27R  [RES0603]  (hidden comment: RES_27R_0603)
R84  value 27R  [RES0603]  (hidden comment: RES_27R_0603)
R85  value 1K5  [RES0603]  (hidden comment: RES_1K5_0603)
R86  value DNP-0Ohm  [RES0603]  (hidden comment: RES_DNP_0603)
R87  120R  [RES0603]
R88  value DNP-0Ohm  [RES0603]  (hidden comment: RES_DNP_0603)
U18  SN65HVD232Q  [SOIC8]
U21  SN65HVD232Q  [SOIC8]

### Ports
CANH0, CANL0, PS_MIO14_500, PS_MIO15_500

### Nets
3V3VD: FB9.1 FB13.1 R85.2  [project net VDD_3V3]
CAN_M_N: C95.2 D10.2 L7.3 R87.1 R88.2
CAN_M_P: C96.2 D10.1 L7.4 R86.2 R87.2
CAN_MCU_N: U21.4(R)  [also labelled CAN_M_RX]
CAN_MCU_P: U21.1(D)  [also labelled CAN_M_TX]
DGND: C83.1 C84.1 C85.1 C91.2 C92.2 C93.2 C94.1 C95.1 C96.1 D8.3 D10.3 J1.5(GND) J1.7(SLD) J1.8(SLD) J1.9(SLD) J1.10(SLD) R82.2 U18.2(GND) U21.2(GND)
USB_N: C92.1 R84.2  [also labelled D-]
USB_P: C93.1 R83.2 R85.1  [also labelled D+]
VIN_3V3: D9.C(K)
CAN_MYIR_N: C84.2 D8.2 L5.3 R80.1 R81.2 ; port CANL0
CAN_MYIR_P: C85.2 D8.1 L5.4 R79.2 R80.2 ; port CANH0
CAN_MYIR_RX: U18.4(R) ; port PS_MIO14_500
CAN_MYIR_TX: U18.1(D) ; port PS_MIO15_500
USB_D_N: J1.2(D-) R84.1
USB_D_P: J1.3(D+) R83.1
NetC83_2: C83.2 FB13.2 U18.3(VCC)
NetC91_1: C91.1 D9.A J1.1(VBUS) R82.1
NetC94_2: C94.2 FB9.2 U21.3(VCC)
NetL5_1: L5.1 R79.1 U18.7(CANH)
NetL5_2: L5.2 R81.1 U18.6(CANL)
NetL7_1: L7.1 R86.1 U21.7(CANH)
NetL7_2: L7.2 R88.1 U21.6(CANL)

Not connected (* = marked no-connect by the designer): J1 4(ID); U18 5(NC)* 8(NC)*; U21 5(NC)* 8(NC)*

### Layout directives
differential pair; CAN: DIFF60: CAN_M_N, CAN_M_P
differential pair: CAN_MCU_N, CAN_MCU_P, CAN_MYIR_N, CAN_MYIR_P, USB_D_N, USB_D_P, USB_N, USB_P

### Notes on the sheet
- MYIR-CANBUS
- CAN0_TX
- CAN0_RX
- USB PORT
- MCU-CANBUS
- CCD_CAM_COMMUNICATION
- 8
- v1.0
- MESAFLIX
- Labels drawn without touching a wire or pin: USB_N

### Library data of the parts
C83 C91 C94 = CAP0603_100nF: as C22 on sheet P4_CCD_CAM_BOARD_MCU; Value: 100nF 50V
C84 C85 C95 C96 = CAP0603_22pF: CAP CER 22PF 50V C0G/NP0 0603; P/N: GRM1885C1H220JA01D; Order Code: DIGI : 490-1411-1-ND; Value: 22pF 50V
C92 = CAP0603_15pF: CAP CER 47PF 50V C0G 0603; Manufacturer: TDK Corporation; ManufacturerPartNumber: CGA3E2C0G1H470J080AA; DetailedDesctiprition: 47pF ±5% 50V Ceramic Capacitor C0G, NP0 0603 (1608 Metric); Value: 47pF 50V; DigikeyPartNumber: 445-5636-1-ND
C93 = CAP0603_15pF: CAP CER 15PF 25V C0G/NP0 0603; Manufacturer: TDK Corporation; ManufacturerPartNumber: CGA3E2C0G1H150J080AA; DetailedDesctiprition: 15pF ±5% 25V Ceramic Capacitor C0G, NP0 0603 (1608 Metric); Value: 15pF 25V; DigikeyPartNumber: 445-5630-1-ND
D8 D10 = SM24CANB-02HTG_TVS: TVS DIODE 24VWM 50VC SOT23-3; Order Code: DIGI : F6707CT-ND; Value: 2Ch
D9 = SS16: Diode Schottky 60V 1A Surface Mount SMA _DO-214AC_; MF: ON Semiconductor; MP: SS16T3G; Price: None; Value: *; Package: DO-214 ON Semiconductor; Availability: Unavailable; SnapEDA_Link: https://www.snapeda.com/parts/SS16/ON%20Semiconductor/view-part/1428535/?ref=snap; Digikey Part Number: SS16T3GOSCT-ND
FB9 FB13 = FB0603_330R@100MHz: as FB1 on sheet P4_CCD_CAM_BOARD_MCU; Value: 330R @ 100MHz
J1 = 1-1734035-1: Conn Mini USB 2.0 Type B RCP 5 POS 0.8mm Solder RA SMD 5 Terminal 1 Port Tray; Centerline_Pitch: .8 mm[.031 in]; Product_Type: Connector; MF: TE Connectivity; Number_of_Positions: 5; MP: 1-1734035-1; Availability: Unavailable; Package: None; Value: *; TE_purchase_URL: https://www.te.com/usa-en/product-1-1734035-1.html?te_bu=Cor&te_type=disp&te_campaign=seda_glo_cor-seda-global-disp-prtnr-fy19-seda-model-bom-cta_sma-317_1&elqCampaignId=32493; Price: None; SnapEDA_Link: https://www.snapeda.com/parts/1-1734035-1/TE%20Connectivity%20AMP%20Connectors/view-part/1088867/?ref=snap; Digikey Part Number: A111050-ND
L5 L7 = IND_744222: Würth CMC 1MH 800MA 2LN 6 KOHM SMD; Digikey Part Number: 732-1485-1-ND; Manufacturer Part Number: 744222
R79 R81 R86 R88 = RES_1K_0603: as R21 on sheet P4_CCD_CAM_BOARD_MCU; DigikeyPartNumber: 311-0.0LDCT-ND
R80 R87 = RES0603_120R: RES SMD 120 OHM 1% 1/10W 0603; Order Code: DIGI : 311-120HRCT-ND; P/N: RC0603FR-07120RL; ART Code: ART0023420; Value: 120R
R82 = RES_1K_0603: Manufacturer: Yageo; ManufacturerPartNumber: AC0603FR-0722KL; DetailedDesctiprition: 22 kOhms ±1% 0.1W, 1/10W Chip Resistor 0603 (1608 Metric) Automotive AEC-Q200, Moisture Resistant Thick Film; DigikeyPartNumber: 311-22KLDCT-ND
R83 R84 = RES_1K_0603: RES SMD 27 OHM 1% 1/10W 0603; Manufacturer: Yageo; ManufacturerPartNumber: RC0603FR-0727RL; DetailedDesctiprition: 27 Ohms ±1% 0.1W, 1/10W Chip Resistor 0603 (1608 Metric)  Thick Film; DigikeyPartNumber: 311-27.0HRCT-ND
R85 = RES_1K_0603: Manufacturer: Yageo; ManufacturerPartNumber: AC0603JR-071K5L; DetailedDesctiprition: 1.5 kOhms ±5% 0.1W, 1/10W Chip Resistor 0603 (1608 Metric) Automotive AEC-Q200, Moisture Resistant Thick Film; DigikeyPartNumber: YAG3645CT-ND
U18 U21 = SN65HVD232QDRQ1_CAN: IC TRANSCEIVER HALF 1/1 8SOIC; Order Code: DIGI : 296-15381-1-ND; Value: CAN; P/N: SN65HVD232QDRQ1

## Sheet P5_CCD_CAM_BOARD_AFE.SchDoc
size A3
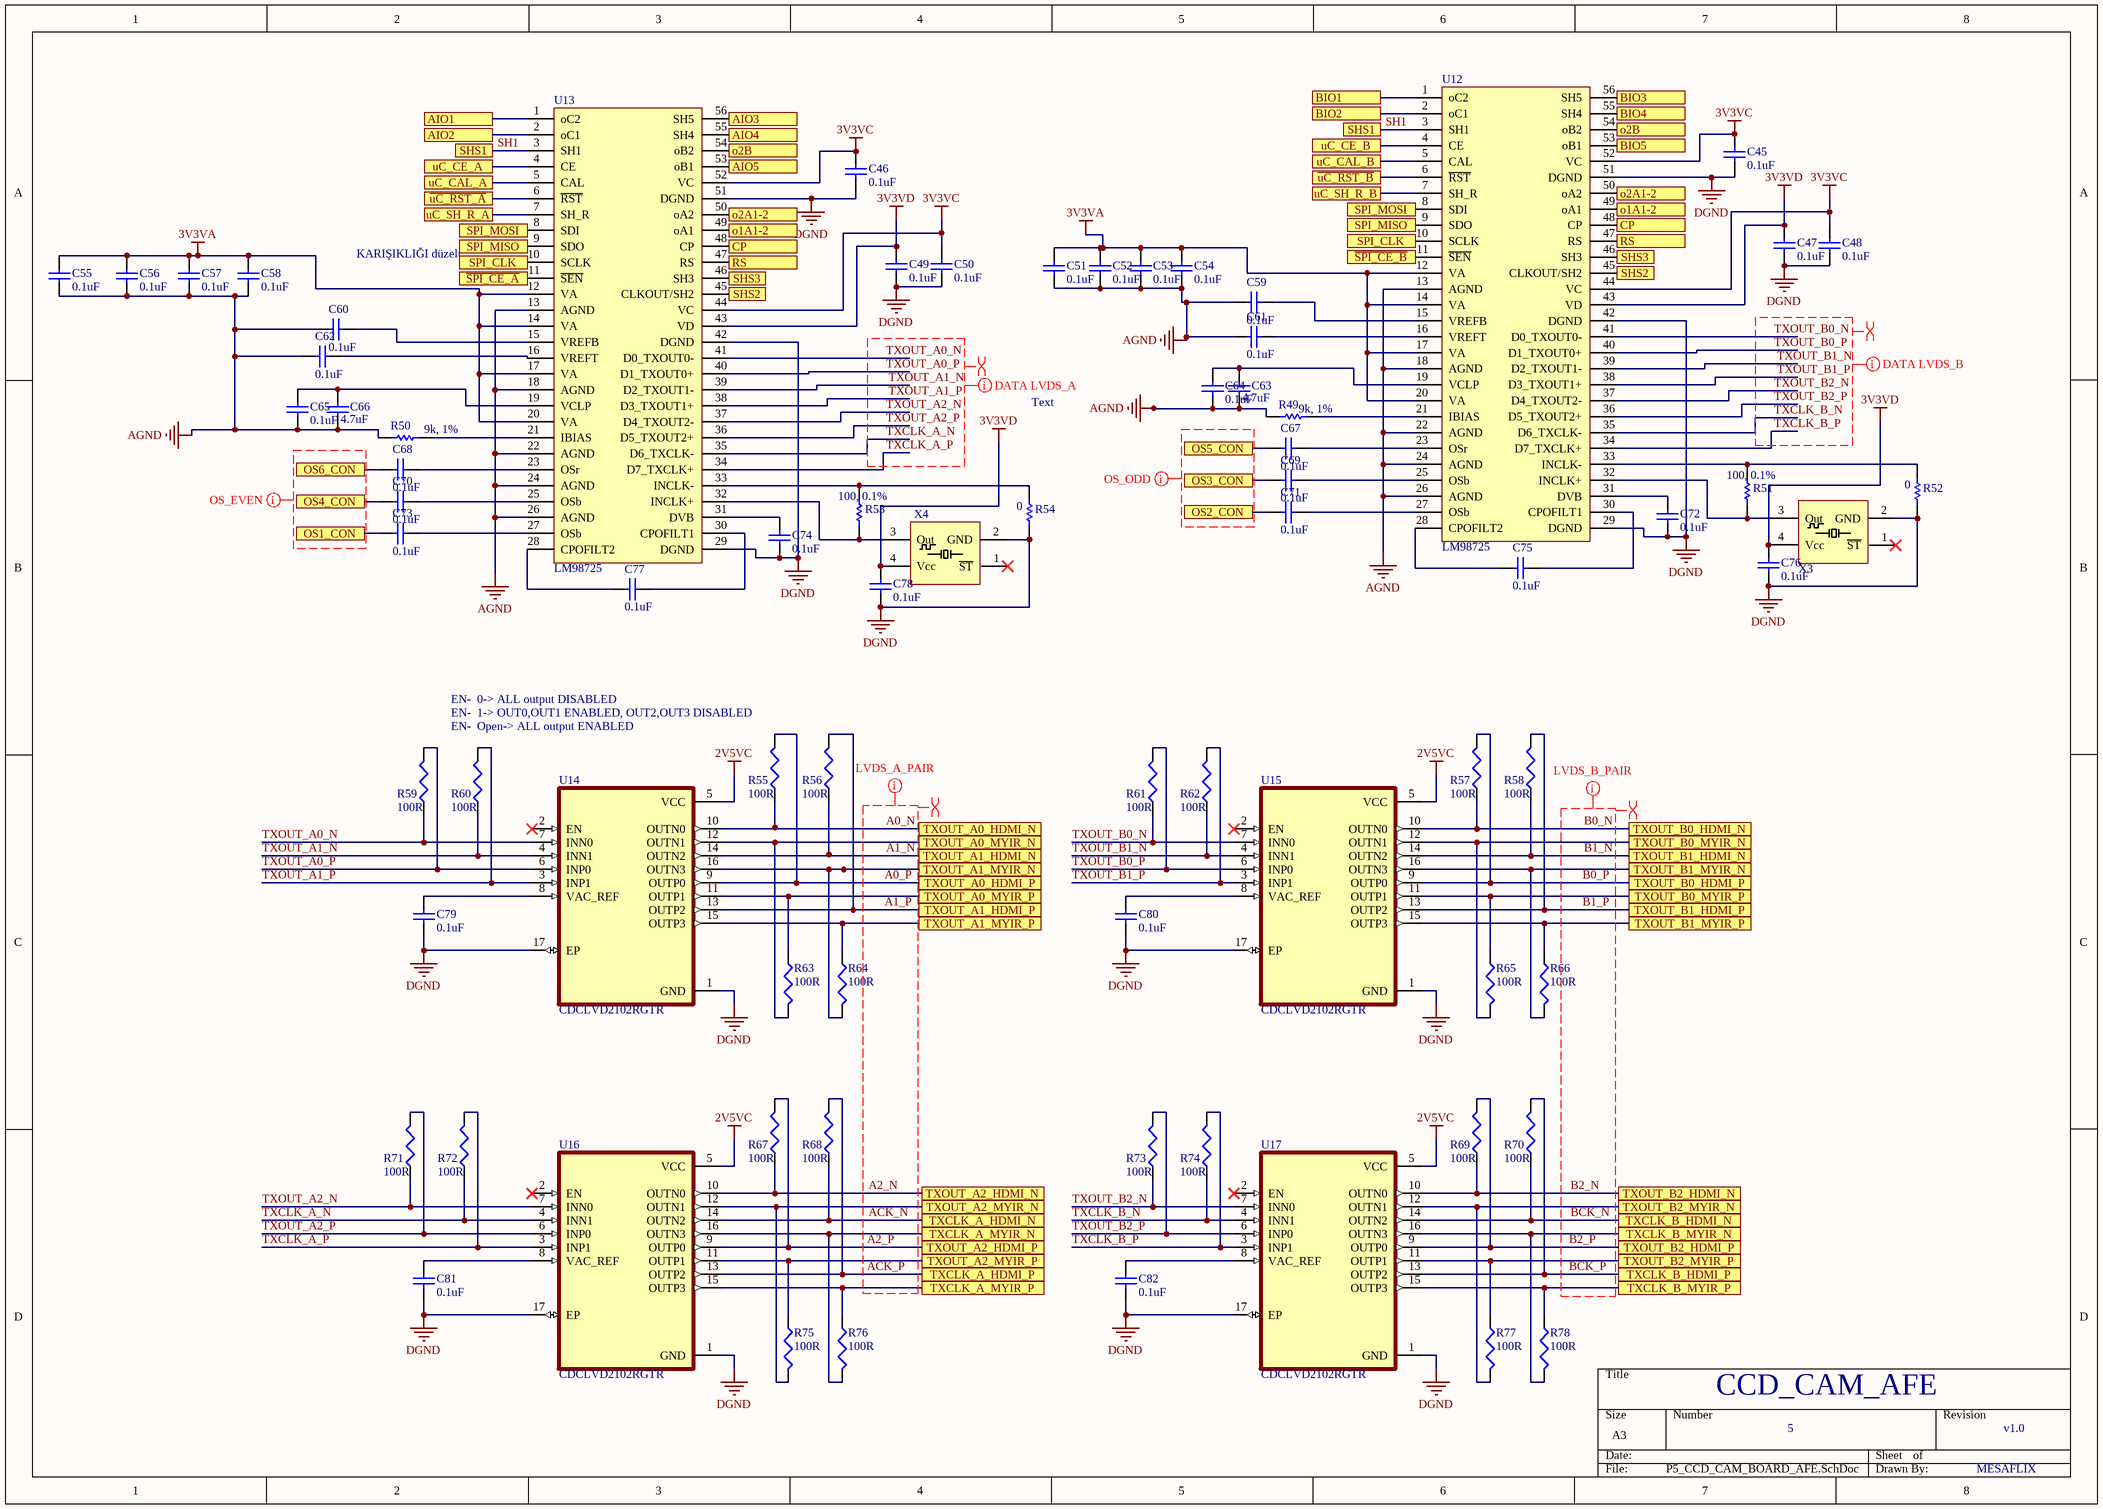
[diagram p4: P5_CCD_CAM_BOARD_AFE.SchDoc]

### Parts
C45  0.1uF  [C 0402(1005)x0.5]
C46  0.1uF  [C 0402(1005)x0.5]
C47  0.1uF  [C 0402(1005)x0.5]
C48  0.1uF  [C 0402(1005)x0.5]
C49  0.1uF  [C 0402(1005)x0.5]
C50  0.1uF  [C 0402(1005)x0.5]
C51  0.1uF  [C 0402(1005)x0.5]
C52  0.1uF  [C 0402(1005)x0.5]
C53  0.1uF  [C 0402(1005)x0.5]
C54  0.1uF  [C 0402(1005)x0.5]
C55  0.1uF  [C 0402(1005)x0.5]
C56  0.1uF  [C 0402(1005)x0.5]
C57  0.1uF  [C 0402(1005)x0.5]
C58  0.1uF  [C 0402(1005)x0.5]
C59  0.1uF  [C 0402(1005)x0.5]
C60  0.1uF  [C 0402(1005)x0.5]
C61  0.1uF  [C 0402(1005)x0.5]
C62  0.1uF  [C 0402(1005)x0.5]
C63  value 4.7uF  [1608[0603]]  (hidden comment: GRM155R71H104KE14J)
C64  0.1uF  [C 0402(1005)x0.5]
C65  0.1uF  [C 0402(1005)x0.5]
C66  value 4.7uF  [1608[0603]]  (hidden comment: GRM155R71H104KE14J)
C67  0.1uF  [C 0402(1005)x0.5]
C68  0.1uF  [C 0402(1005)x0.5]
C69  0.1uF  [C 0402(1005)x0.5]
C70  0.1uF  [C 0402(1005)x0.5]
C71  0.1uF  [C 0402(1005)x0.5]
C72  0.1uF  [C 0402(1005)x0.5]
C73  0.1uF  [C 0402(1005)x0.5]
C74  0.1uF  [C 0402(1005)x0.5]
C75  0.1uF  [C 0402(1005)x0.5]
C76  0.1uF  [C 0402(1005)x0.5]
C77  0.1uF  [C 0402(1005)x0.5]
C78  0.1uF  [C 0402(1005)x0.5]
C79  0.1uF  [C 0402(1005)x0.5]
C80  0.1uF  [C 0402(1005)x0.5]
C81  0.1uF  [C 0402(1005)x0.5]
C82  0.1uF  [C 0402(1005)x0.5]
R49  value 9k, 1%  [0603 (1608)]  (hidden comment: RN731JTTD8981D25)
R50  value 9k, 1%  [0603 (1608)]  (hidden comment: RN731JTTD8981D25)
R51  value 100, 0.1%  [R 0402(1005)]  (hidden comment: RG1005P-101-B-T5)
R52  value 0  [R 0402(1005)]  (hidden comment: ERJ-3GEY0R00V)
R53  value 100, 0.1%  [R 0402(1005)]  (hidden comment: RG1005P-101-B-T5)
R54  value 0  [R 0402(1005)]  (hidden comment: ERJ-3GEY0R00V)
R55  100R  [R 0402(1005)]
R56  100R  [R 0402(1005)]
R57  100R  [R 0402(1005)]
R58  100R  [R 0402(1005)]
R59  100R  [R 0402(1005)]
R60  100R  [R 0402(1005)]
R61  100R  [R 0402(1005)]
R62  100R  [R 0402(1005)]
R63  100R  [R 0402(1005)]
R64  100R  [R 0402(1005)]
R65  100R  [R 0402(1005)]
R66  100R  [R 0402(1005)]
R67  100R  [R 0402(1005)]
R68  100R  [R 0402(1005)]
R69  100R  [R 0402(1005)]
R70  100R  [R 0402(1005)]
R71  100R  [R 0402(1005)]
R72  100R  [R 0402(1005)]
R73  100R  [R 0402(1005)]
R74  100R  [R 0402(1005)]
R75  100R  [R 0402(1005)]
R76  100R  [R 0402(1005)]
R77  100R  [R 0402(1005)]
R78  100R  [R 0402(1005)]
U12  LM98725  [SOP50P810X110-56N]
U13  LM98725  [SOP50P810X110-56N]
U14  CDCLVD2102RGTR  [QFN50P300X300X100-17N]
U15  CDCLVD2102RGTR  [QFN50P300X300X100-17N]
U16  CDCLVD2102RGTR  [QFN50P300X300X100-17N]
U17  CDCLVD2102RGTR  [QFN50P300X300X100-17N]
X3  SG-310SCF 25.0000  [SG-310SCF 25.0000MB3]  (value not drawn)
X4  SG-310SCF 25.0000  [SG-310SCF 25.0000MB3]  (value not drawn)

### Ports
AIO1, AIO2, AIO3, AIO4, AIO5, BIO1, BIO2, BIO3, BIO4, BIO5, CP, o1A1-2, o2A1-2, o2B, OS1_CON, OS2_CON, OS3_CON, OS4_CON, OS5_CON, OS6_CON, RS, SHS1, SHS2, SHS3, SPI_CLK, SPI_MISO, SPI_MOSI, TXCLK_A_HDMI_N, TXCLK_A_HDMI_P, TXCLK_A_MYIR_N, TXCLK_A_MYIR_P, TXCLK_B_HDMI_N, TXCLK_B_HDMI_P, TXCLK_B_MYIR_N, TXCLK_B_MYIR_P, TXOUT_A0_HDMI_N, TXOUT_A0_HDMI_P, TXOUT_A0_MYIR_N, TXOUT_A0_MYIR_P, TXOUT_A1_HDMI_N, TXOUT_A1_HDMI_P, TXOUT_A1_MYIR_N, TXOUT_A1_MYIR_P, TXOUT_A2_HDMI_N, TXOUT_A2_HDMI_P, TXOUT_A2_MYIR_N, TXOUT_A2_MYIR_P, TXOUT_B0_HDMI_N, TXOUT_B0_HDMI_P, TXOUT_B0_MYIR_N, TXOUT_B0_MYIR_P, TXOUT_B1_HDMI_N, TXOUT_B1_HDMI_P, TXOUT_B1_MYIR_N, TXOUT_B1_MYIR_P, TXOUT_B2_HDMI_N, TXOUT_B2_HDMI_P, TXOUT_B2_MYIR_N, TXOUT_B2_MYIR_P, uC_CAL_A, uC_CAL_B, uC_CE_A, uC_CE_B, uC_SH_R_A, uC_SH_R_B, ~{SPI_CE_A}, ~{SPI_CE_B}, ~{uC_RST_A}, ~{uC_RST_B}

### Nets
2V5VC: U14.5(VCC) U15.5(VCC) U16.5(VCC) U17.5(VCC)
3V3VA: C51.2 C52.2 C53.2 C54.2 C55.2 C56.2 C57.2 C58.2 U12.12(VA) U12.14(VA) U12.17(VA) U12.20(VA) U13.12(VA) U13.14(VA) U13.17(VA) U13.20(VA)
3V3VC: C45.2 C46.2 C48.2 C50.2 U12.44(VC) U12.52(VC) U13.44(VC) U13.52(VC)
3V3VD: C47.2 C49.2 C76.2 C78.2 U12.43(VD) U13.43(VD) X3.4(Vcc) X4.4(Vcc)  [project net VDD_3V3]
AGND: C51.1 C52.1 C53.1 C54.1 C55.1 C56.1 C57.1 C58.1 C59.2 C60.2 C61.2 C62.2 C63.1 C64.2 C65.1 C66.1 R49.2 R50.2 U12.13(AGND) U12.18(AGND) U12.22(AGND) U12.24(AGND) U12.26(AGND) U13.13(AGND) U13.18(AGND) U13.22(AGND) U13.24(AGND) U13.26(AGND)
DGND: C45.1 C46.1 C47.1 C48.1 C49.1 C50.1 C72.1 C74.1 C76.1 C78.1 C79.1 C80.1 C81.1 C82.1 R52.2 R54.2 U12.29(DGND) U12.42(DGND) U12.51(DGND) U13.29(DGND) U13.42(DGND) U13.51(DGND) U14.1(GND) U14.17(EP) U15.1(GND) U15.17(EP) U16.1(GND) U16.17(EP) U17.1(GND) U17.17(EP) X3.2(GND) X4.2(GND)
A0_N: R55.1 U14.10(OUTN0) ; port TXOUT_A0_HDMI_N
A0_P: R55.2 U14.9(OUTP0) ; port TXOUT_A0_HDMI_P
A1_N: R56.1 U14.14(OUTN2) ; port TXOUT_A1_HDMI_N
A1_P: R56.2 U14.13(OUTP2) ; port TXOUT_A1_HDMI_P
A2_N: R67.1 U16.10(OUTN0) ; port TXOUT_A2_HDMI_N
A2_P: R67.2 U16.9(OUTP0) ; port TXOUT_A2_HDMI_P
ACK_N: R68.1 U16.14(OUTN2) ; port TXCLK_A_HDMI_N
ACK_P: R68.2 U16.13(OUTP2) ; port TXCLK_A_HDMI_P
B0_N: R57.1 U15.10(OUTN0) ; port TXOUT_B0_HDMI_N
B0_P: R57.2 U15.9(OUTP0) ; port TXOUT_B0_HDMI_P
B1_N: R58.1 U15.14(OUTN2) ; port TXOUT_B1_HDMI_N
B1_P: R58.2 U15.13(OUTP2) ; port TXOUT_B1_HDMI_P
B2_N: R69.1 U17.10(OUTN0) ; port TXOUT_B2_HDMI_N
B2_P: R69.2 U17.9(OUTP0) ; port TXOUT_B2_HDMI_P
BCK_N: R70.1 U17.14(OUTN2) ; port TXCLK_B_HDMI_N
BCK_P: R70.2 U17.13(OUTP2) ; port TXCLK_B_HDMI_P
CP: U12.48(CP) U13.48(CP) ; port CP
IO_L9_T1_35_N: R63.2 U14.12(OUTN1) ; port TXOUT_A0_MYIR_N
IO_L9_T1_35_P: R63.1 U14.11(OUTP1) ; port TXOUT_A0_MYIR_P
IO_L10_T1_35_N: R64.2 U14.16(OUTN3) ; port TXOUT_A1_MYIR_N
IO_L10_T1_35_P: R64.1 U14.15(OUTP3) ; port TXOUT_A1_MYIR_P
IO_L11_T1_35_N: R76.2 U16.16(OUTN3) ; port TXCLK_A_MYIR_N
IO_L11_T1_35_P: R76.1 U16.15(OUTP3) ; port TXCLK_A_MYIR_P
IO_L13_35_N: R78.2 U17.16(OUTN3) ; port TXCLK_B_MYIR_N
IO_L13_35_P: R78.1 U17.15(OUTP3) ; port TXCLK_B_MYIR_P
IO_L14_T2_35_N: R75.2 U16.12(OUTN1) ; port TXOUT_A2_MYIR_N
IO_L14_T2_35_P: R75.1 U16.11(OUTP1) ; port TXOUT_A2_MYIR_P
IO_L15_T2_35_N: R65.2 U15.12(OUTN1) ; port TXOUT_B0_MYIR_N
IO_L15_T2_35_P: R65.1 U15.11(OUTP1) ; port TXOUT_B0_MYIR_P
IO_L16_T2_35_N: R66.2 U15.16(OUTN3) ; port TXOUT_B1_MYIR_N
IO_L16_T2_35_P: R66.1 U15.15(OUTP3) ; port TXOUT_B1_MYIR_P
IO_L18_T2_35_N: R77.2 U17.12(OUTN1) ; port TXOUT_B2_MYIR_N
IO_L18_T2_35_P: R77.1 U17.11(OUTP1) ; port TXOUT_B2_MYIR_P
o1A1-2: U12.49(oA1) U13.49(oA1) ; port o1A1-2
o2A1-2: U12.50(oA2) U13.50(oA2) ; port o2A1-2
o2B: U12.54(oB2) U13.54(oB2) ; port o2B
OS1_CON: C73.2 ; port OS1_CON
OS2_CON: C71.2 ; port OS2_CON
OS3_CON: C69.2 ; port OS3_CON
OS4_CON: C70.2 ; port OS4_CON
OS5_CON: C67.2 ; port OS5_CON
OS6_CON: C68.2 ; port OS6_CON
RS: U12.47(RS) U13.47(RS) ; port RS
SH1: U12.3(SH1) U13.3(SH1) ; port SHS1
TXCLK_A_N: R72.1 U13.35(D6_TXCLK-) U16.4(INN1)
TXCLK_A_P: R72.2 U13.34(D7_TXCLK+) U16.3(INP1)
TXCLK_B_N: R74.1 U12.35(D6_TXCLK-) U17.4(INN1)
TXCLK_B_P: R74.2 U12.34(D7_TXCLK+) U17.3(INP1)
TXOUT_A0_N: R59.1 U13.41(D0_TXOUT0-) U14.7(INN0)
TXOUT_A0_P: R59.2 U13.40(D1_TXOUT0+) U14.6(INP0)
TXOUT_A1_N: R60.1 U13.39(D2_TXOUT1-) U14.4(INN1)
TXOUT_A1_P: R60.2 U13.38(D3_TXOUT1+) U14.3(INP1)
TXOUT_A2_N: R71.1 U13.37(D4_TXOUT2-) U16.7(INN0)
TXOUT_A2_P: R71.2 U13.36(D5_TXOUT2+) U16.6(INP0)
TXOUT_B0_N: R61.1 U12.41(D0_TXOUT0-) U15.7(INN0)
TXOUT_B0_P: R61.2 U12.40(D1_TXOUT0+) U15.6(INP0)
TXOUT_B1_N: R62.1 U12.39(D2_TXOUT1-) U15.4(INN1)
TXOUT_B1_P: R62.2 U12.38(D3_TXOUT1+) U15.3(INP1)
TXOUT_B2_N: R73.1 U12.37(D4_TXOUT2-) U17.7(INN0)
TXOUT_B2_P: R73.2 U12.36(D5_TXOUT2+) U17.6(INP0)
NetC59_1: C59.1 U12.15(VREFB)
NetC60_1: C60.1 U13.15(VREFB)
NetC61_1: C61.1 U12.16(VREFT)
NetC62_1: C62.1 U13.16(VREFT)
NetC63_2: C63.2 C64.1 U12.19(VCLP)
NetC65_2: C65.2 C66.2 U13.19(VCLP)
NetC67_1: C67.1 U12.23(OSr)
NetC68_1: C68.1 U13.23(OSr)
NetC69_1: C69.1 U12.25(OSb)
NetC70_1: C70.1 U13.25(OSb)
NetC71_1: C71.1 U12.27(OSb)
NetC72_2: C72.2 U12.31(DVB)
NetC73_1: C73.1 U13.27(OSb)
NetC74_2: C74.2 U13.31(DVB)
NetC75_1: C75.1 U12.30(CPOFILT1)
NetC75_2: C75.2 U12.28(CPOFILT2)
NetC77_1: C77.1 U13.30(CPOFILT1)
NetC77_2: C77.2 U13.28(CPOFILT2)
NetC79_2: C79.2 U14.8(VAC_REF)
NetC80_2: C80.2 U15.8(VAC_REF)
NetC81_2: C81.2 U16.8(VAC_REF)
NetC82_2: C82.2 U17.8(VAC_REF)
NetJ8_10: U12.46(SH3) U13.46(SH3) ; port SHS3
NetJ8_11: U12.45(CLKOUT/SH2) U13.45(CLKOUT/SH2) ; port SHS2
NetR21_1: U13.11(~{SEN}) ; port ~{SPI_CE_A}
NetR22_1: U12.10(SCLK) U13.10(SCLK) ; port SPI_CLK
NetR23_1: U12.9(SDO) U13.9(SDO) ; port SPI_MISO
NetR24_1: U12.8(SDI) U13.8(SDI) ; port SPI_MOSI
NetR27_2: U13.7(SH_R) ; port uC_SH_R_A
NetR28_2: U13.6(~{RST}) ; port ~{uC_RST_A}
NetR29_1: U12.4(CE) ; port uC_CE_B
NetR30_2: U13.5(CAL) ; port uC_CAL_A
NetR31_2: U13.4(CE) ; port uC_CE_A
NetR33_2: U12.11(~{SEN}) ; port ~{SPI_CE_B}
NetR34_2: U12.7(SH_R) ; port uC_SH_R_B
NetR35_2: U12.6(~{RST}) ; port ~{uC_RST_B}
NetR36_2: U12.5(CAL) ; port uC_CAL_B
NetR49_1: R49.1 U12.21(IBIAS)
NetR50_1: R50.1 U13.21(IBIAS)
NetR51_1: R51.1 R52.1 U12.33(INCLK-)
NetR51_2: R51.2 U12.32(INCLK+) X3.3(Out)
NetR53_1: R53.1 R54.1 U13.33(INCLK-)
NetR53_2: R53.2 U13.32(INCLK+) X4.3(Out)
NetR104_2: U13.1(oC2) ; port AIO1
NetR105_2: U13.2(oC1) ; port AIO2
NetR106_1: U13.56(SH5) ; port AIO3
NetR107_2: U12.53(oB1) ; port BIO5
NetR108_1: U13.55(SH4) ; port AIO4
NetR109_2: U12.1(oC2) ; port BIO1
NetR110_1: U13.53(oB1) ; port AIO5
NetR111_2: U12.2(oC1) ; port BIO2
NetR112_2: U12.56(SH5) ; port BIO3
NetR113_2: U12.55(SH4) ; port BIO4

Not connected (* = marked no-connect by the designer): U14 2(EN)*; U15 2(EN)*; U16 2(EN)*; U17 2(EN)*; X3 1(~{ST})*; X4 1(~{ST})*

### Layout directives
rule Matched Net Lengths [Tolerance = 0.05mm]; net class DATA_LVDS: TXCLK_A_N, TXCLK_A_P, TXCLK_B_N, TXCLK_B_P, TXOUT_A0_N, TXOUT_A0_P, TXOUT_A1_N, TXOUT_A1_P, TXOUT_A2_N, TXOUT_A2_P, TXOUT_B0_N, TXOUT_B0_P, TXOUT_B1_N, TXOUT_B1_P, TXOUT_B2_N, TXOUT_B2_P
rule Matched Net Lengths [Tolerance = 0.05mm]; net class oses: (no net found under the mark)
differential pair: A0_N, A0_P, A1_N, A1_P, A2_N, A2_P, ACK_N, ACK_P, B0_N, B0_P, B1_N, B1_P, B2_N, B2_P, BCK_N, BCK_P, TXCLK_A_N, TXCLK_A_P, TXCLK_B_N, TXCLK_B_P, TXOUT_A0_N, TXOUT_A0_P, TXOUT_A1_N, TXOUT_A1_P, TXOUT_A2_N, TXOUT_A2_P, TXOUT_B0_N, TXOUT_B0_P, TXOUT_B1_N, TXOUT_B1_P, TXOUT_B2_N, TXOUT_B2_P
mark named LVDS_A_PAIR: A0_N, A0_P, A1_N, A1_P, A2_N, A2_P, ACK_N, ACK_P
mark named LVDS_B_PAIR: B0_N, B0_P, B1_N, B1_P, B2_N, B2_P, BCK_N, BCK_P

### Notes on the sheet
- KARIŞIKLIĞI düzelt
- Text
- EN-  1-> OUT0,OUT1 ENABLED, OUT2,OUT3 DISABLED
- EN-  0-> ALL output DISABLED
- EN-  Open-> ALL output ENABLED
- CCD_CAM_AFE
- 5
- v1.0
- MESAFLIX

### Library data of the parts
C45-C62 C64 C65 C67-C82 = Cap: as C16 on sheet P4_CCD_CAM_BOARD_MCU; Supplier 1: Digi-Key; Supplier Part Number 1: 490-3261-6-ND; Stock 1: 141162259; Pricing 1: 1 = 0,10000, 10 = 0,03300, 100 = 0,01470, 500 = 0,01046, 1000 = 0,00822, 2500 = 0,00748, 5000 = 0,00688 (USD); RoHS: Yes; Mount: Surface Mount; Case/Package: 0402; Number of Pins: 2; Case Code (Metric): 1005; Case Code (Imperial): 0402; Dielectric Material: Ceramic; Min Operating Temperature: -55°C; Max Operating Temperature: 125°C; Packaging: Tape and Reel; Voltage Rating (DC): 16V; Package Quantity: 1; Termination: SMD/SMT; Voltage: 16V; Length: 1mm; Height: 0.5mm; Width: 0.5mm; Thickness: 0.022inch; Depth: 0.5mm; Radiation Hardening: No; REACH SVHC: No SVHC; Lead Free: Lead Free; ComponentLink1URL: https://datasheet.ciiva.com/18102/getdatasheetpartid-85307-18102905.pdf?src-supplier=Verical; ComponentLink1Description: https://datasheet.ciiva.com/18102/getdatasheetpartid-85307-18102905.pdf?src-supplier=Verical; ComponentLink2URL: https://datasheet.ciiva.com/129/grm155r71c104ka88-01-129739.pdf?src-supplier=Digi-Key; ComponentLink2Description: https://datasheet.ciiva.com/129/grm155r71c104ka88-01-129739.pdf?src-supplier=Digi-Key; ComponentLink3URL: https://datasheet.ciiva.com/129/grm155r71c104ka88-01-129740.pdf?src-supplier=Digi-Key; ComponentLink3Description: https://datasheet.ciiva.com/129/grm155r71c104ka88-01-129740.pdf?src-supplier=Digi-Key; ComponentLink4URL: https://datasheet.ciiva.com/29199/454098-da-01-en-vs-kondensator-0402-29199799.pdf?src-supplier=Conrad; ComponentLink4Description: https://datasheet.ciiva.com/29199/454098-da-01-en-vs-kondensator-0402-29199799.pdf?src-supplier=Conrad; ComponentLink5URL: https://datasheet.ciiva.com/28534/4360-28534133.pdf?src-supplier=Element14; ComponentLink5Description: https://datasheet.ciiva.com/28534/4360-28534133.pdf?src-supplier=Element14; ComponentLink6URL: https://datasheet.ciiva.com/14103/grmseries-highdielectrictype-eng-14103750.pdf?src-supplier=Distrelec; ComponentLink6Description: https://datasheet.ciiva.com/14103/grmseries-highdielectrictype-eng-14103750.pdf?src-supplier=Distrelec; ComponentLink7URL: https://datasheet.ciiva.com/16199/product-16199000.pdf?src-supplier=Future+Electronics; ComponentLink7Description: https://datasheet.ciiva.com/16199/product-16199000.pdf?src-supplier=Future+Electronics; ComponentLink8URL: https://datasheet.ciiva.com/14116/grmseries-highdielectrictype-eng-14116878.pdf?src-supplier=Distrelec; ComponentLink8Description: https://datasheet.ciiva.com/14116/grmseries-highdielectrictype-eng-14116878.pdf?src-supplier=Distrelec; ComponentLink9URL: https://datasheet.ciiva.com/7937/4360-7937615.pdf?src-supplier=Element14; ComponentLink9Description: https://datasheet.ciiva.com/7937/4360-7937615.pdf?src-supplier=Element14; ComponentLink10URL: https://datasheet.ciiva.com/28534/4360-28534127.pdf?src-supplier=Element14; ComponentLink10Description: https://datasheet.ciiva.com/28534/4360-28534127.pdf?src-supplier=Element14
C63 C66 = Cap: Capacitor; Mfr Part #: CL10A475KA8NQNC
R49 R50 = Res Semi: Semiconductor Resistor; Mfr Part #: RN73H1ETTP8981F25
R51 R53 = Res Semi: RES SMD 100 OHM 0.1% 1/16W 0402; Mfr Part #: RG1005P-101-B-T5
R52 R54 = Res Semi: Semiconductor Resistor; Mfr Part #: RC0603JR-070RL
R55-R78 = RES0603_100R: RES SMD 100R OHM 1% 1/10W 0603; Order Code: DIGI : RMCF0603FT100RCT-ND; P/N: RMCF0603FT100R; ART Code: ART0022201; Value: 100R
U14-U17 = CDCLVD2102RGTR: Low Jitter, Dual 1:2 Universal-to-LVDS Buffer 16-VQFN -40 to 85; MF: Texas Instruments; MP: CDCLVD2102RGTR; Package: VQFN-16 Texas Instruments; SnapEDA_Link: https://www.snapeda.com/parts/CDCLVD2102RGTR/Texas%20Instruments/view-part/1060724/?ref=snap; Check_prices: https://www.snapeda.com/parts/CDCLVD2102RGTR/Texas%20Instruments/view-part/1060724/?ref=eda; Value: *; Digi-Key_Part_Number: 296-CDCLVD2102RGCT-ND
X3 X4 = SG-310SCF 25.0000: Ceramic Base SMD Crystal 25MHz, 18pf
U12 U13 = LM98725: Mfr Part #: LM98725